# Altium project nano_carrier_V_1_1.PrjPcb
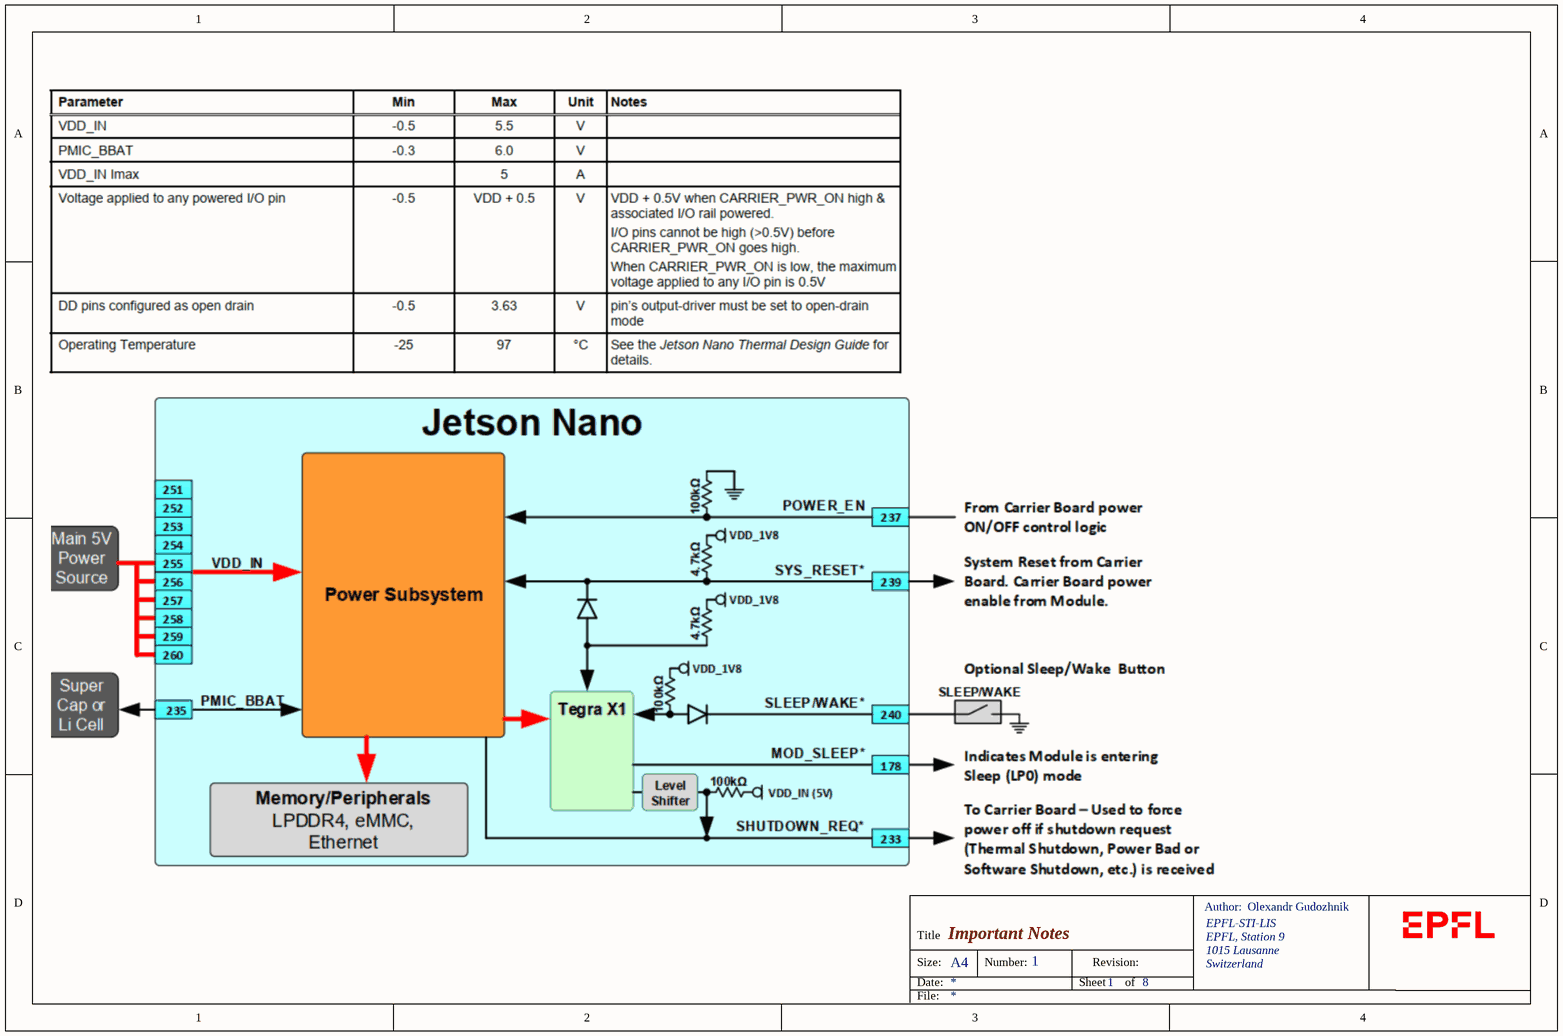
[diagram p0: notes.SchDoc]

8 sheets, 168 parts. Net scope: global (net labels, ports and power ports of the same name join across sheets).
Board file: nano_carrier_pcb.PcbDoc
Sheets:
  notes.SchDoc
  power.SchDoc
  jetson_nano_module.SchDoc
  uart.SchDoc
  usb.SchDoc
  uSDcard.SchDoc
  hdmi.SchDoc
  csi_cam.SchDoc

## Sheet notes.SchDoc: Important Notes
size A4; Author: Olexandr Gudozhnik; Organization: EPFL-STI-LIS; Address1: EPFL, Station 9; Address2: 1015 Lausanne; Address3: Switzerland; DocumentNumber: 1; SheetNumber: 1; SheetTotal: 8

### Notes on the sheet
- Author:
- Title
- Size:
- Date:
- A4
- Number:
- Sheet
- Revision:
- of
- File:

## Sheet power.SchDoc: Power supplies & sequencing
size A4; Author: Olexandr Gudozhnik; Organization: EPFL-STI-LIS; Address1: EPFL, Station 9; Address2: 1015 Lausanne; Address3: Switzerland; DocumentNumber: 2; SheetNumber: 2; SheetTotal: 8
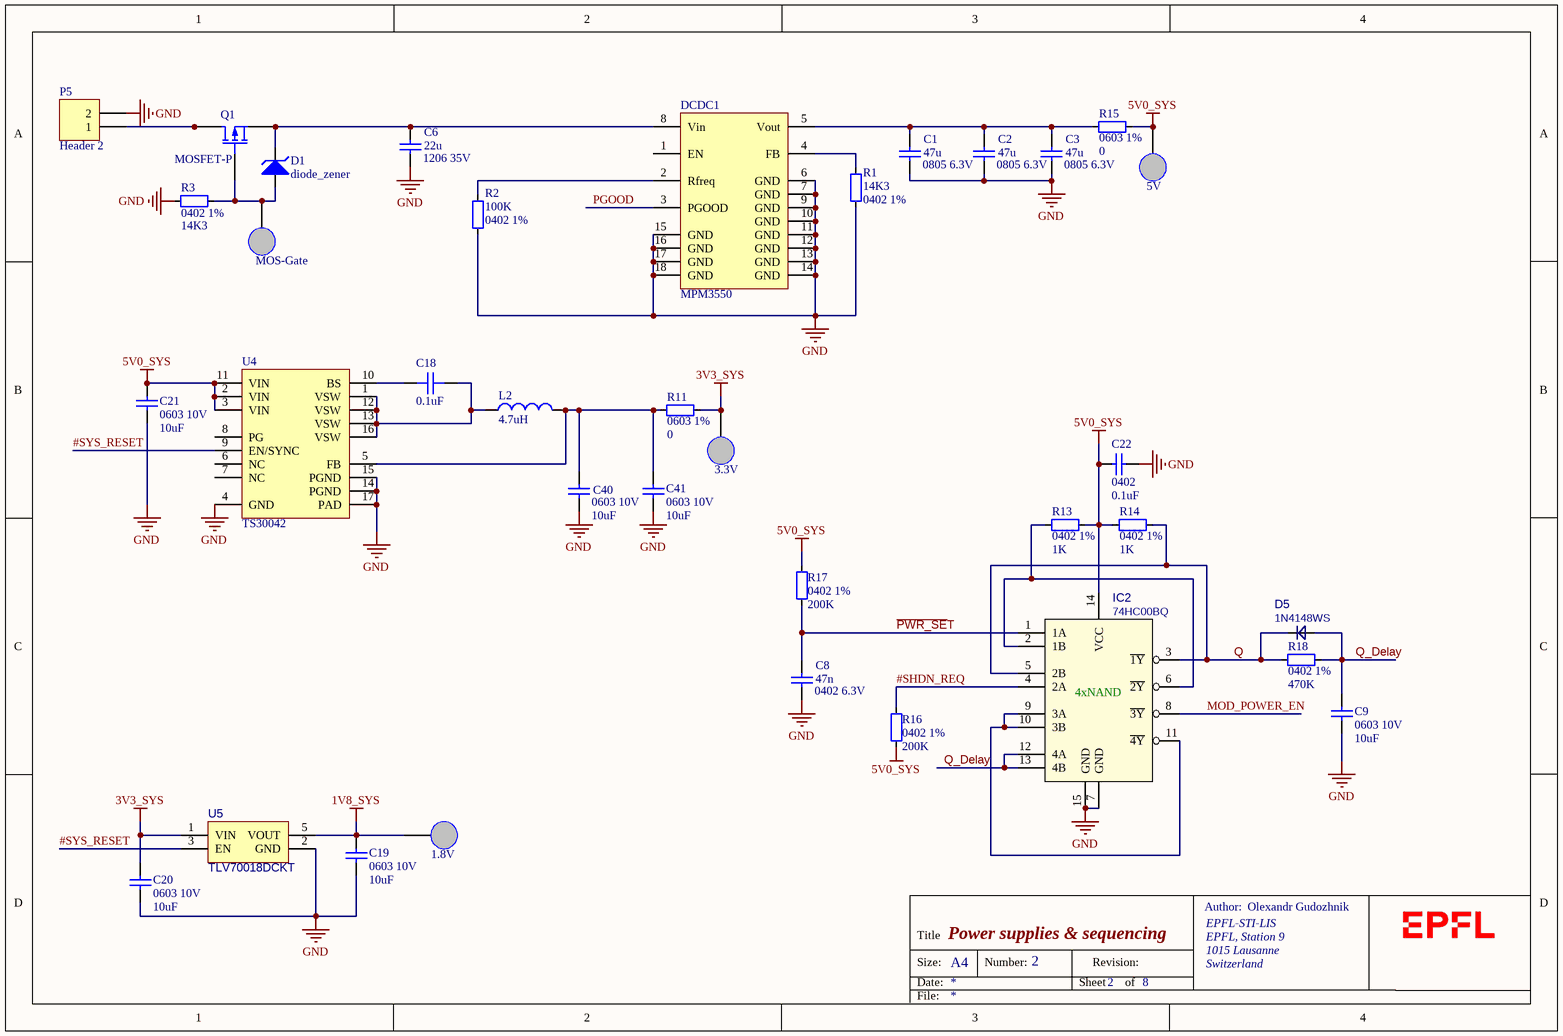
[diagram p1: power.SchDoc]

### Parts
1.8V  TP  [test_point]  (value not drawn)  (no BOM)
3.3V  TP  [test_point]  (value not drawn)  (no BOM)
5V  TP  [test_point]  (value not drawn)  (no BOM)
C1  0805 6.3V  value 47u  [cap0805]
C2  0805 6.3V  value 47u  [cap0805]
C3  0805 6.3V  value 47u  [cap0805]
C6  1206 35V  value 22u  [cap1206]
C8  0402 6.3V  value 47n  [cap0402]
C9  0603 10V  value 10uF  [cap0603]
C18  value 0.1uF  [CAP0603]  (hidden comment: .Value)
C19  0603 10V  value 10uF  [cap0603]
C20  0603 10V  value 10uF  [cap0603]
C21  0603 10V  value 10uF  [cap0603]
C22  0402  value 0.1uF  [cap0402]
C40  0603 10V  value 10uF  [cap0603]
C41  0603 10V  value 10uF  [cap0603]
D1  diode_zener  [sod323]
D5  1N4148WS  [SOD-323]
DCDC1  MPM3550  [MPM3550E]
IC2  74HC00BQ  [DHVQFN14]
L2  value 4.7uH  [NRS5030]  (hidden comment: Inductor)
MOS-Gate  TP  [test_point]  (value not drawn)  (no BOM)
P5  Header 2  [xt30_fem_hor]
Q1  MOSFET-P  [DFN8_5x6]
R1  0402 1%  value 14K3  [res0402]
R2  0402 1%  value 100K  [res0402]
R3  0402 1%  value 14K3  [res0402]
R11  0603 1%  value 0  [res0603]
R13  0402 1%  value 1K  [res0402]
R14  0402 1%  value 1K  [res0402]
R15  0603 1%  value 0  [res0603]
R16  0402 1%  value 200K  [res0402]
R17  0402 1%  value 200K  [res0402]
R18  0402 1%  value 470K  [res0402]
U4  TS30042  [qfn16_TP]
U5  TLV70018DCKT  [SC70-5]

### Nets
1V8_SYS: 1.8V.1(TP) C19.2 U5.5(VOUT)
3V3_SYS: 3.3V.1(TP) C20.2 R11.1 U5.1(VIN)
5V0_SYS: 5V.1(TP) C21.2 C22.2 IC2.14(VCC) R13.1 R14.2 R15.1 R16.2 R17.1 U4.2(VIN) U4.3(VIN) U4.11(VIN)
GND: C1.2 C2.2 C3.2 C6.2 C8.2 C9.1 C19.1 C20.1 C21.1 C22.1 C40.1 C41.1 DCDC1.6(GND) DCDC1.7(GND) DCDC1.9(GND) DCDC1.10(GND) DCDC1.11(GND) DCDC1.12(GND) DCDC1.13(GND) DCDC1.14(GND) DCDC1.15(GND) DCDC1.16(GND) DCDC1.17(GND) DCDC1.18(GND) IC2.7(GND) IC2.15(GND) P5.2 R1.1 R2.1 R3.2 U4.4(GND) U4.14(PGND) U4.15(PGND) U4.17(PAD) U5.2(GND)
#SHDN_REQ: IC2.4(2A) R16.1
#SYS_RESET: U4.9(EN/SYNC) U5.3(EN)
~{PWR_SE}T: C8.1 IC2.1(1A) R17.2
MOD_POWER_EN: IC2.8(~{3Y})
PGOOD: DCDC1.3(PGOOD)
Q: D5.C IC2.3(~{1Y}) IC2.5(2B) R14.1 R18.2
Q_Delay: C9.2 D5.A IC2.12(4A) IC2.13(4B) R18.1
NetC1_1: C1.1 C2.1 C3.1 DCDC1.5(Vout) R15.2
NetC6_1: C6.1 D1.2(K) DCDC1.8(Vin) Q1.1(S) Q1.2(S) Q1.3(S)
NetC18_1: C18.1 U4.10(BS)
NetC18_2: C18.2 L2.1 U4.1(VSW) U4.12(VSW) U4.13(VSW) U4.16(VSW)
NetC40_2: C40.2 C41.2 L2.2 R11.2 U4.5(FB)
NetD1_1: D1.1(A) MOS-Gate.1(TP) Q1.4(G) R3.1
NetDCDC1_2: DCDC1.2(Rfreq) R2.2
NetDCDC1_4: DCDC1.4(FB) R1.2
NetIC2_2: IC2.2(1B) IC2.6(~{2Y}) R13.2
NetIC2_9: IC2.9(3A) IC2.10(3B) IC2.11(~{4Y})
NetP5_1: P5.1 Q1.5(D) Q1.6(D) Q1.7(D) Q1.8(D)

Not connected (* = marked no-connect by the designer): DCDC1 1(EN); U4 6(NC) 7(NC) 8(PG)

### Notes on the sheet
- Author:
- Title
- Size:
- Date:
- A4
- Number:
- Sheet
- Revision:
- of
- File:
- (in symbol 74HC00BQ) 4xNAND

### Library data of the parts
1.8V 3.3V 5V MOS-Gate = TP: Test point
C1-C3 C6 C8 = cap_no_param: Supplier 1: Digi-Key
  C1-C3: Supplier Part Number 1: 587-4280-1-ND
  C6: Supplier Part Number 1: 445-8045-1-ND
  C8: Supplier Part Number 1: 490-6335-1-ND
C9 C19-C22 C40 C41 = cap: standard, non-polarized capacitor; Supplier 1: Digi-Key; Footprint verified: no
  C9 C19-C21 C40 C41: Supplier Part Number 1: 490-10474-1-ND; Supplier Price 1: 0.23
  C22: Supplier Part Number 1: 490-14603-1-ND; Supplier Price 1: 0.08
C18 = capacitor_smd_0603_25V: Ceramic capacitor, SMD, 0603, 25V, 10%, X7R; PackageReference: RAD-0.3; PackageDescription: Radial Cap, Thru-Hole; 2 Leads; 0.3 in Pin Spacing; Digikey Unit Price: 0.08; Supplier 1: Digi-Key; Supplier Part Number 1: 490-6051-1-ND
D1 = diode_zener: Zener diode; Published: 8-Jun-2000; LatestRevisionDate: 17-Jul-2002; LatestRevisionNote: Re-released for DXP Platform.; PackageReference: DIODE-0.7; Publisher: Altium Limited; PackageDescription: Diode, Thru-Hole; 2 Leads; 0.7 in Pin Spacing; Supplier 1: Digi-Key; Supplier Part Number 1: MMSZ5240BS-FDICT-ND
D5 = diode: Diode small signal; Manufacturer: ON SEMICONDUCTOR; PartNumber: 1N4148WS; Value: 1N4148WS; PartSymbol: 1N4148WS; Supplier 1: Digi-Key; Supplier Part Number 1: 1N4148WSFSCT-ND
IC2 = 74HC00BQ: 2 NAND Gate, 4 channel; Manufacturer: NEXPERIA; PartNumber: 74HC00BQ; Value: 74HC00BQ; PartSymbol: 74HC00BQ; Supplier 1: Digi-Key; Supplier Part Number 1: 1727-3213-1-ND
L2 = Inductor: Code_IEC: 1005; PackageReference: 0402-A; PackageDescription: Chip Inductor; Code_JEITA: 0402; dIGIKEY rEF: 445-2182-1-ND; Supplier 1: Digi-Key; Supplier Part Number 1: 587-3605-1-ND
P5 = Header 2: Header, 2-Pin; LatestRevisionDate: 17-Jul-2002; LatestRevisionNote: Re-released for DXP Platform.; Publisher: Altium Limited
Q1 = pmos_dfn8: P-Channel MOSFET in DFN8 package (DFN5); Published: 8-Jun-2000; LatestRevisionDate: 17-Jul-2002; LatestRevisionNote: Re-released for DXP Platform.; PackageVersion: 1995/1996; PackageReference: E3; Publisher: Altium Limited; PackageDescription: TO, Flat Index; 3 In-Line, Axial Leads; Body Dia. 4.6mm; Lead Dia. 0.5 mm (max); Supplier 1: Digi-Key; Supplier Part Number 1: FDWS9508L-F085OSCT-ND
R1 R3 = res: Supplier 1: Digi-Key; Supplier Part Number 1: P14.3KLCT-ND
R2 R11 R13-R18 = res: 100K; Supplier 1: Digi-Key
  R2: Supplier Part Number 1: P100KLCT-ND
  R11 R15: Supplier Part Number 1: 311-0.0GRCT-ND
  R13 R14: Supplier Part Number 1: P1.00KLCT-ND
  R16 R17: Supplier Part Number 1: P200KLCT-ND
  R18: Supplier Part Number 1: P470KLCT-ND
U4 = TS30042: 40V,2A  synch voltage reg, QFN16 3x3mm; Manufacturer: National Semiconductor; PackageTopMarking: NS*UZXYTT*S0003LB; CompType: Switcher; PowerWise: N; PackageReference: SRC14A; RevisionNote: Component URLs added; PackageVersion: revA, Jul-2003; PackageDescription: LLP, Plastic, Dual, 6 x 5 x 1mm Body, 14 Lead, 0.8mm Pitch, No Pullback; PinCount: 14; Digikey Ref: LM2676SD-12/NOPBCT-ND; Footprint verified: no; Supplier 1: Digi-Key; Supplier Part Number 1: TS30042-M033QFNRCT-ND
U5 = TLV700: Voltage Regulator, 2V to 5.5V, 175mV Dropout, 1.8Vout, 200mAout; Manufacturer: TEXAS INSTRUMENTS; Value: TLV70018DCKT; PartNumber: TLV70018DCKT; PartSymbol: TLV70018DCKT; Supplier 1: Digi-Key; Supplier Part Number 1: 296-25269-1-ND
DCDC1 = MPM3550: Supplier 1: Digi-Key; Supplier Part Number 1: 1589-2043-ND

## Sheet jetson_nano_module.SchDoc: Jetson Nano Module
size A3; Author: Olexandr Gudozhnik; Organization: EPFL-STI-LIS; Address1: EPFL, Station 9; Address2: 1015, Lausanne; Address3: Switzerland; DocumentNumber: 3; SheetNumber: 3; SheetTotal: 8
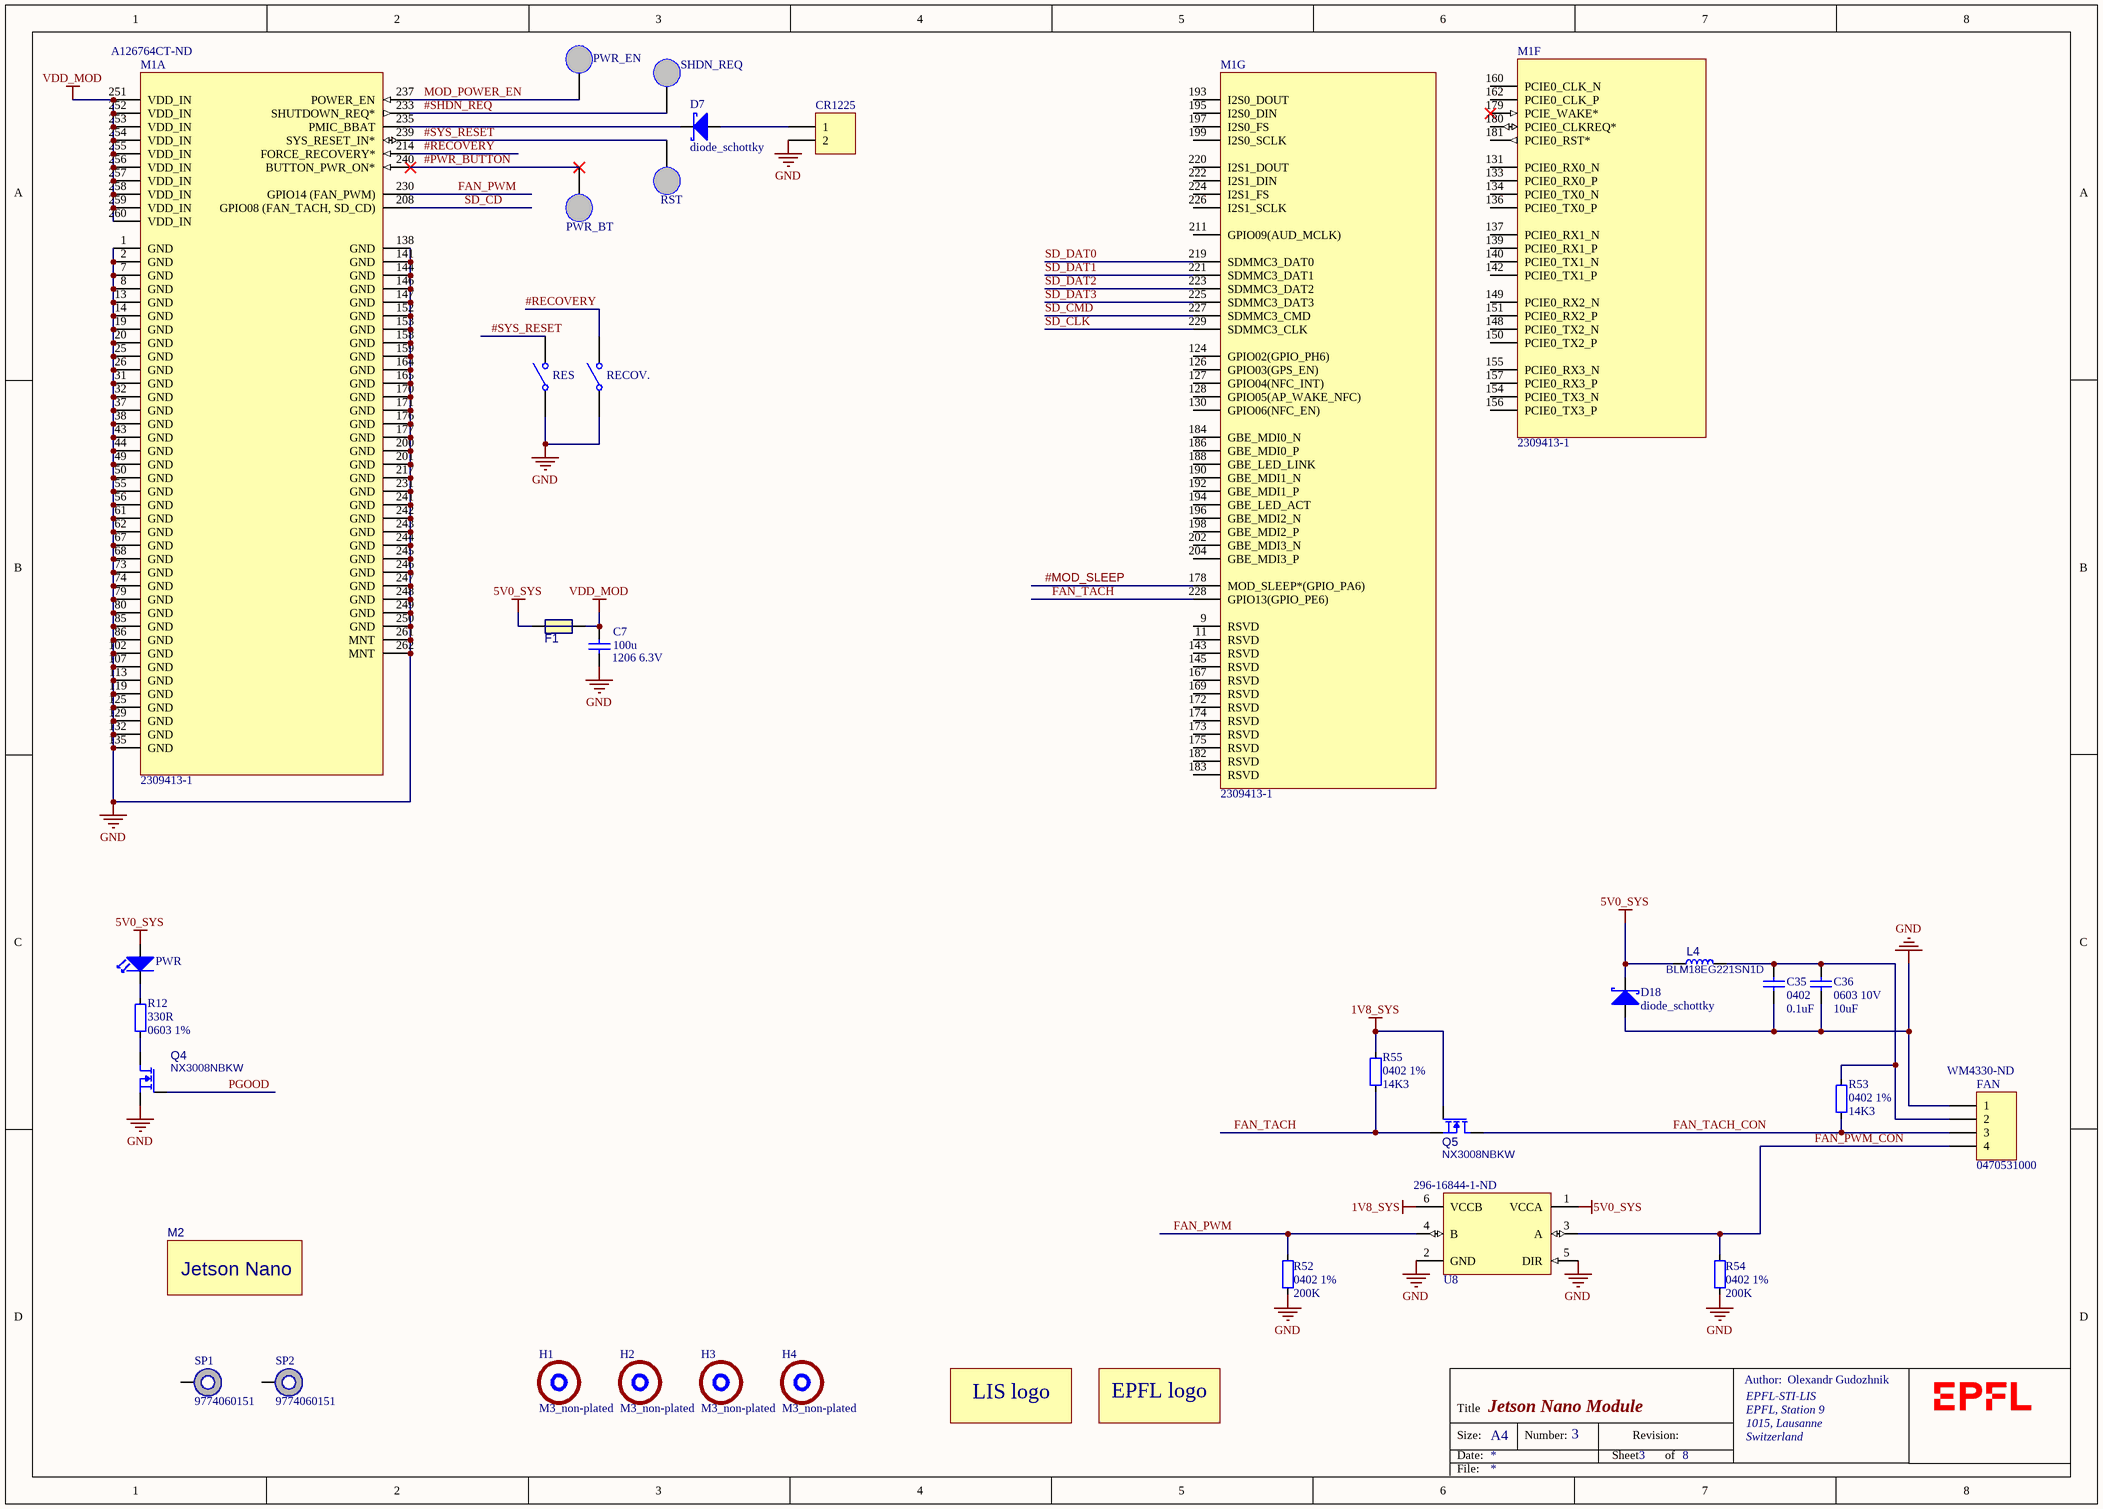
[diagram p2: jetson_nano_module.SchDoc]

### Parts
C7  1206 6.3V  value 100u  [cap1206]
C35  0402  value 0.1uF  [cap0402]
C36  0603 10V  value 10uF  [cap0603]
CR1225  Header 2  [CR1225_Holder]  (value not drawn)
D7  diode_schottky  [DFN1608D-2]
D18  diode_schottky  [DFN1608D-2]
F1  1206L450SLWR  [res1206]  (value not drawn)
FAN  0470531000  Supplier Part Number 1: WM4330-ND  [47053-1000]
H1  M3_non-plated  [M3_NON_PLATED]  (no BOM)
H2  M3_non-plated  [M3_NON_PLATED]  (no BOM)
H3  M3_non-plated  [M3_NON_PLATED]  (no BOM)
H4  M3_non-plated  [M3_NON_PLATED]  (no BOM)
L4  BLM18EG221SN1D  [fb0603]
logo1  LIS_LOGO  [lis_logo]  (value not drawn)  (graphical)
logo2  EPFL_LOGO  [epfl_logo]  (value not drawn)  (graphical)
M1  2309413-1  Supplier Part Number 1: A126764CT-ND  [jetson-nano-connector]  (parts A,F,G of 7)
M2  (no value)  [jetson-nano-module]  (no BOM)
PWR  green LED  [led_0603]  (value not drawn)
PWR_BT  TP  [test_point]  (value not drawn)  (no BOM)
PWR_EN  TP  [test_point]  (value not drawn)  (no BOM)
Q4  NX3008NBKW  [SC70-3]
Q5  NX3008NBKW  [SC70-3]
R12  0603 1%  value 330R  [res0603]
R52  0402 1%  value 200K  [res0402]
R53  0402 1%  value 14K3  [res0402]
R54  0402 1%  value 200K  [res0402]
R55  0402 1%  value 14K3  [res0402]
RECOV.  B3U1000P  [b3u_1000p]  (value not drawn)
RES  B3U1000P  [b3u_1000p]  (value not drawn)
RST  TP  [test_point]  (value not drawn)  (no BOM)
SHDN_REQ  TP  [test_point]  (value not drawn)  (no BOM)
SP1  9774060151  [M2.5-6mm]  (mechanical)
SP2  9774060151  [M2.5-6mm]  (mechanical)
U8  Supplier Part Number 1: 296-16844-1-ND  [SC70-6]  (hidden comment: SN74LVC1T45)

### Nets
1V8_SYS: Q5.1(G) R55.1 U8.6(VCCB)
5V0_SYS: D18.1(K) F1.1 L4.1 PWR.1(A) U8.1(VCCA)
GND: C7.2 C35.1 C36.2 CR1225.2 D18.2(A) FAN.1 M1.1(GND) M1.2(GND) M1.7(GND) M1.8(GND) M1.13(GND) M1.14(GND) M1.19(GND) M1.20(GND) M1.25(GND) M1.26(GND) M1.31(GND) M1.32(GND) M1.37(GND) M1.38(GND) M1.43(GND) M1.44(GND) M1.49(GND) M1.50(GND) M1.55(GND) M1.56(GND) M1.61(GND) M1.62(GND) M1.67(GND) M1.68(GND) M1.73(GND) M1.74(GND) M1.79(GND) M1.80(GND) M1.85(GND) M1.86(GND) M1.102(GND) M1.107(GND) M1.113(GND) M1.119(GND) M1.125(GND) M1.129(GND) M1.132(GND) M1.135(GND) M1.138(GND) M1.141(GND) M1.144(GND) M1.146(GND) M1.147(GND) M1.152(GND) M1.153(GND) M1.158(GND) M1.159(GND) M1.164(GND) M1.165(GND) M1.170(GND) M1.171(GND) M1.176(GND) M1.177(GND) M1.200(GND) M1.201(GND) M1.217(GND) M1.231(GND) M1.241(GND) M1.242(GND) M1.243(GND) M1.244(GND) M1.245(GND) M1.246(GND) M1.247(GND) M1.248(GND) M1.249(GND) M1.250(GND) M1.261(MNT) M1.262(MNT) Q4.2(S) R52.2 R54.2 RECOV..1(COMMON) RES.1(COMMON) U8.2(GND) U8.5(DIR)
VDD_MOD: C7.1 F1.2 M1.251(VDD_IN) M1.252(VDD_IN) M1.253(VDD_IN) M1.254(VDD_IN) M1.255(VDD_IN) M1.256(VDD_IN) M1.257(VDD_IN) M1.258(VDD_IN) M1.259(VDD_IN) M1.260(VDD_IN)
#MOD_SLEEP: M1.178(MOD_SLEEP*(GPIO_PA6))
#PWR_BUTTON: M1.240(BUTTON_PWR_ON*) PWR_BT.1(TP)
#RECOVERY: M1.214(FORCE_RECOVERY*) RECOV..2(NO)
#SHDN_REQ: M1.233(SHUTDOWN_REQ*) SHDN_REQ.1(TP)
#SYS_RESET: M1.239(SYS_RESET_IN*) RES.2(NO) RST.1(TP)
FAN_PWM: M1.230(GPIO14_(FAN_PWM)) R52.1 U8.4(B)
FAN_PWM_CON: FAN.4 R54.1 U8.3(A)
FAN_TACH: M1.228(GPIO13(GPIO_PE6)) Q5.2(S) R55.2
FAN_TACH_CON: FAN.3 Q5.3(D) R53.2
MOD_POWER_EN: M1.237(POWER_EN) PWR_EN.1(TP)
PGOOD: Q4.1(G)
SD_CD: M1.208(GPIO08_(FAN_TACH,_SD_CD))
SD_CLK: M1.229(SDMMC3_CLK)
SD_CMD: M1.227(SDMMC3_CMD)
SD_DAT0: M1.219(SDMMC3_DAT0)
SD_DAT1: M1.221(SDMMC3_DAT1)
SD_DAT2: M1.223(SDMMC3_DAT2)
SD_DAT3: M1.225(SDMMC3_DAT3)
NetC35_2: C35.2 C36.1 FAN.2 L4.2 R53.1
NetCR1225_1: CR1225.1 D7.2(A)
NetD7_1: D7.1(K) M1.235(PMIC_BBAT)
NetPWR_2: PWR.2(K) R12.2
NetQ4_3: Q4.3(D) R12.1

Not connected (* = marked no-connect by the designer): M1 9(RSVD) 11(RSVD) 124(GPIO02(GPIO_PH6)) 126(GPIO03(GPS_EN)) 127(GPIO04(NFC_INT)) 128(GPIO05(AP_WAKE_NFC)) 130(GPIO06(NFC_EN)) 131(PCIE0_RX0_N) 133(PCIE0_RX0_P) 134(PCIE0_TX0_N) 136(PCIE0_TX0_P) 137(PCIE0_RX1_N) 139(PCIE0_RX1_P) 140(PCIE0_TX1_N) 142(PCIE0_TX1_P) 143(RSVD) 145(RSVD) 148(PCIE0_TX2_N) 149(PCIE0_RX2_N) 150(PCIE0_TX2_P) 151(PCIE0_RX2_P) 154(PCIE0_TX3_N) 155(PCIE0_RX3_N) 156(PCIE0_TX3_P) 157(PCIE0_RX3_P) 160(PCIE0_CLK_N) 162(PCIE0_CLK_P) 167(RSVD) 169(RSVD) 172(RSVD) 173(RSVD) 174(RSVD) 175(RSVD) 179(PCIE_WAKE*)* 180(PCIE0_CLKREQ*) 181(PCIE0_RST*) 182(RSVD) 183(RSVD) 184(GBE_MDI0_N) 186(GBE_MDI0_P) 188(GBE_LED_LINK) 190(GBE_MDI1_N) 192(GBE_MDI1_P) 193(I2S0_DOUT) 194(GBE_LED_ACT) 195(I2S0_DIN) 196(GBE_MDI2_N) 197(I2S0_FS) 198(GBE_MDI2_P) 199(I2S0_SCLK) 202(GBE_MDI3_N) 204(GBE_MDI3_P) 211(GPIO09(AUD_MCLK)) 220(I2S1_DOUT) 222(I2S1_DIN) 224(I2S1_FS) 226(I2S1_SCLK); SP1 1; SP2 1

### Notes on the sheet
- Author:
- Title
- Size:
- Date:
- A4
- Number:
- Sheet
- Revision:
- of
- File:
- (in symbol EPFL_LOGO) EPFL logo
- (in symbol jetson-nano-module) Jetson Nano
- (in symbol LIS_LOGO) LIS logo

### Library data of the parts
C7 = cap_no_param: Supplier 1: Digi-Key; Supplier Part Number 1: 399-5620-1-ND
C35 C36 = cap: standard, non-polarized capacitor; Supplier 1: Digi-Key; Footprint verified: no
  C35: Supplier Part Number 1: 490-14603-1-ND; Supplier Price 1: 0.08
  C36: Supplier Part Number 1: 490-10474-1-ND; Supplier Price 1: 0.23
CR1225 = Header 2: Header, 2-Pin; LatestRevisionDate: 17-Jul-2002; LatestRevisionNote: Re-released for DXP Platform.; Publisher: Altium Limited; Supplier 1: Digi-Key; Supplier Part Number 1: 36-3000CT-ND
D7 D18 = diode_schottky: Schottky diode; Published: 8-Jun-2000; LatestRevisionDate: 17-Jul-2002; LatestRevisionNote: Re-released for DXP Platform.; PackageReference: SMB; Publisher: Altium Limited; PackageDescription: DO-214-AA/SMB; 2 C-Bend Leads; Body 5.3 x 3.6 mm, inc. leads (LxW); Code_JEDEC: DO-214-AA; Supplier 1: Digi-Key; Supplier Part Number 1: 1727-1338-1-ND
F1 = Fuse: PTC RESET 6V LO RHO 1206 4.50A; PartNumber: LITTELFUSE_1206L450SLWR; Manufacturer: LITTELFUSE; Value: 1206L450SLWR; PartSymbol: 1206L450SLWR; Supplier 1: Digi-Key; Supplier Part Number 1: F5787CT-ND
FAN = Header 4: Fan header, 4-Pin; LatestRevisionDate: 17-Jul-2002; LatestRevisionNote: Re-released for DXP Platform.; Publisher: Altium Limited; Supplier 1: Digi-Key
H1-H4 = M3_non-plated_hole
L4 = BLM18EG221SN1D: MURATA  BLM18EG221SN1D  FERRITE BEAD, 0.05OHM, 2A, 0603; Value: BLM18EG221SN1D; Manufacturer: MURATA; PartNumber: BLM18EG221SN1D; PartSymbol: BLM18EG221SN1D; Supplier 1: Digi-Key; Supplier Part Number 1: 490-3992-1-ND
M1 = 2309413-1: Memory Socket, DDR4, SODIMM Socket, 260 Contacts, Copper Alloy, Gold Plated Contacts; Manufacturer: TE CONNECTIVITY; PartNumber: 2309413-1; Value: 2309413-1; PartSymbol: 2309413-1; Supplier 1: Digi-Key
M2 = jetson-nano-module: PartNumber: jetson-nano-module
PWR = diode_LED: Green LED 0603; Supplier 1: Digi-Key; Supplier Part Number 1: 475-2709-1-ND
PWR_BT PWR_EN RST SHDN_REQ = TP: Test point
Q4 Q5 = NMOS: MOSFET, N CH, 60V, 0.2A; Manufacturer: NXP; PartSymbol: BSS138PW; Value: NX3008NBKW; PartNumber: NX3008NBKW; Supplier 1: Digi-Key; Supplier Part Number 1: 1727-1280-1-ND
R12 R53 R55 = res: Supplier 1: Digi-Key
  R12: Supplier Part Number 1: 311-330HRCT-ND
  R53 R55: Supplier Part Number 1: P14.3KLCT-ND
R52 R54 = res: 100K; Supplier 1: Digi-Key
  R52: Supplier Part Number 1: P200KLCT-ND
  R54: Supplier Part Number 1: P100KLCT-ND
RECOV. RES = SW-SPST: Single-Pole, Single-Throw Switch; Published: 24-Mar-1999; LatestRevisionDate: 17-Jul-2002; LatestRevisionNote: Re-released for DXP Platform.; PackageReference: SPST-2; Publisher: Altium Limited; PackageDescription: Switch; 2 Leads; Supplier 1: Digi-Key; Supplier Part Number 1: SW1020CT-ND
SP1 SP2 = SPACER: M2.5-6mm; PartNumber: M2.5x6; Manufacturer: WURTH ELEKTRONIK; Value: 9774060151; PartSymbol: 9774060151; Supplier 1: Digi-Key; Supplier Part Number 1: 732-12984-ND
U8 = SN74LVC1T45: 1.8 - 5.5V fast level translator; Supplier 1: Digi-Key

## Sheet uart.SchDoc: UART & I2C
size A3; Author: Olexandr Gudozhnik; Organization: EPFL-STI-LIS; Address1: EPFL, Station 9; Address2: 1015, Lausanne; Address3: Switzerland; DocumentNumber: 4; SheetNumber: 4; SheetTotal: 8
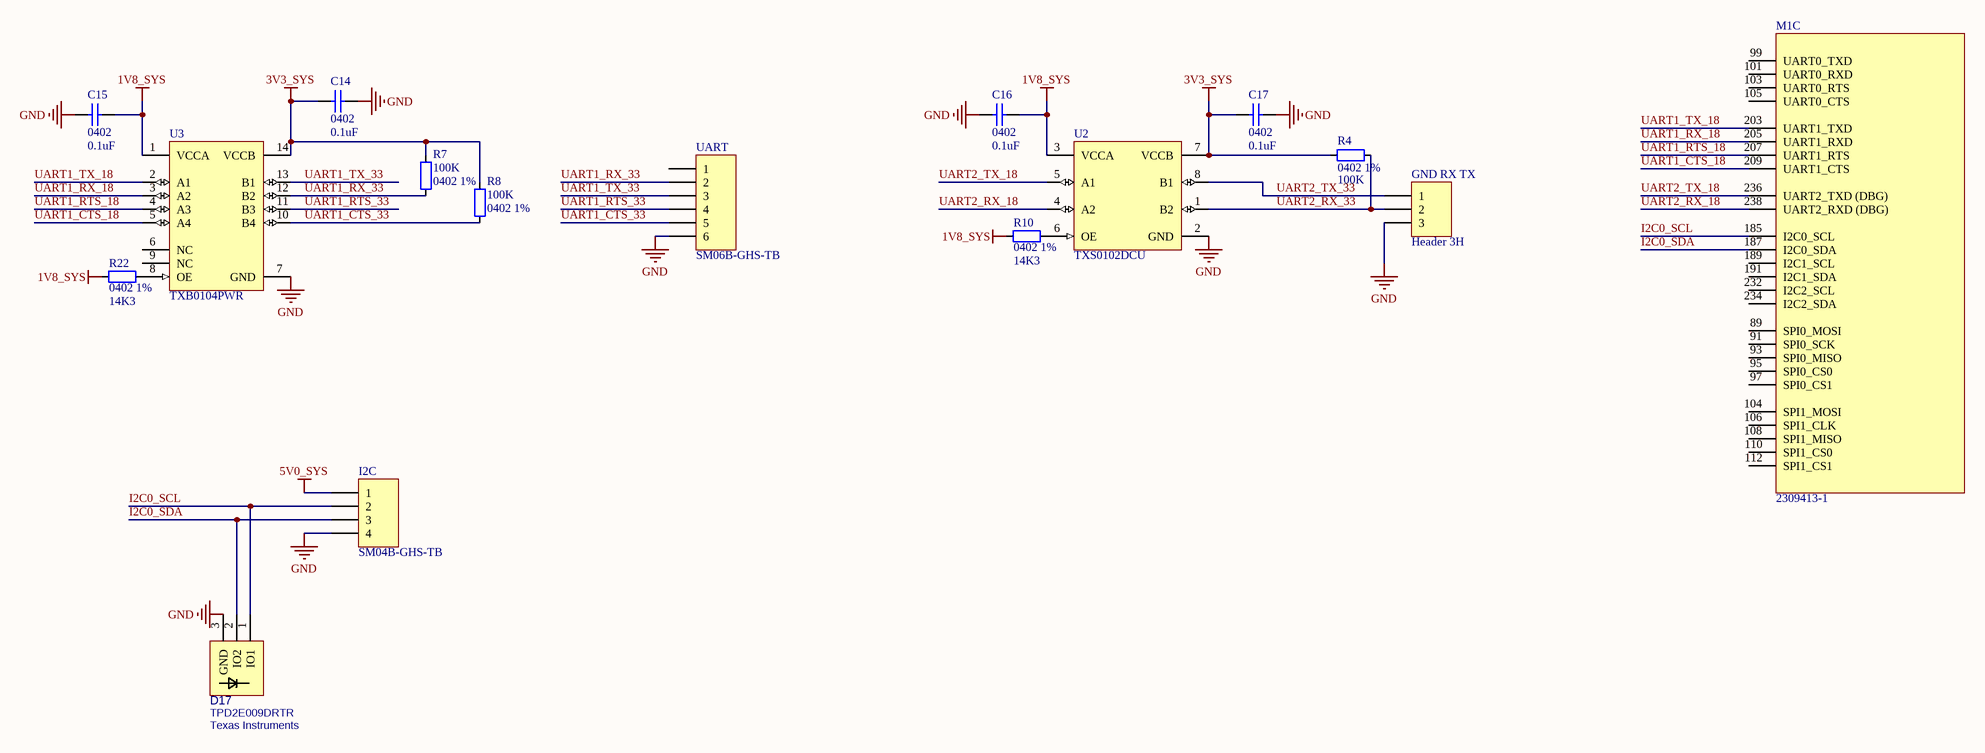
[diagram p3: uart.SchDoc]

### Parts
C14  0402  value 0.1uF  [cap0402]
C15  0402  value 0.1uF  [cap0402]
C16  0402  value 0.1uF  [cap0402]
C17  0402  value 0.1uF  [cap0402]
D17  TPD2E009DRTR  Manufacturer: Texas Instruments  [SOT-3]
GND_RX_TX  Header 3H  [header_vert_2.54_3pin]
I2C  SM04B-GHS-TB  [JST_GH_4_side]
M1  2309413-1  [jetson-nano-connector]  (part C of 7)
R4  0402 1%  value 100K  [res0402]
R7  0402 1%  value 100K  [res0402]
R8  0402 1%  value 100K  [res0402]
R10  0402 1%  value 14K3  [res0402]
R22  0402 1%  value 14K3  [res0402]
U2  TXS0102DCU  [TSOP8_065pitch]
U3  TXB0104PWR  [PW0014A_L]
UART  SM06B-GHS-TB  [JST_GH_6_side]

### Nets
1V8_SYS: C15.1 C16.1 R10.2 R22.2 U2.3(VCCA) U3.1(VCCA)
3V3_SYS: C14.2 C17.2 R4.2 R7.2 R8.2 U2.7(VCCB) U3.14(VCCB)
5V0_SYS: I2C.1
GND: C14.1 C15.2 C16.2 C17.1 D17.3(GND) GND_RX_TX.3 I2C.4 U2.2(GND) U3.7(GND) UART.6
I2C0_SCL: D17.1(IO1) I2C.2 M1.185(I2C0_SCL)
I2C0_SDA: D17.2(IO2) I2C.3 M1.187(I2C0_SDA)
UART1_CTS_18: M1.209(UART1_CTS) U3.5(A4)
UART1_CTS_33: R8.1 U3.10(B4) UART.5
UART1_RTS_18: M1.207(UART1_RTS) U3.4(A3)
UART1_RTS_33: U3.11(B3) UART.4
UART1_RX_18: M1.205(UART1_RXD) U3.3(A2)
UART1_RX_33: R7.1 U3.12(B2) UART.2
UART1_TX_18: M1.203(UART1_TXD) U3.2(A1)
UART1_TX_33: U3.13(B1) UART.3
UART2_RX_18: M1.238(UART2_RXD_(DBG)) U2.4(A2)
UART2_RX_33: GND_RX_TX.2 R4.1 U2.1(B2)
UART2_TX_18: M1.236(UART2_TXD_(DBG)) U2.5(A1)
UART2_TX_33: GND_RX_TX.1 U2.8(B1)
NetR10_1: R10.1 U2.6(OE)
NetR22_1: R22.1 U3.8(OE)

Not connected (* = marked no-connect by the designer): M1 89(SPI0_MOSI) 91(SPI0_SCK) 93(SPI0_MISO) 95(SPI0_CS0) 97(SPI0_CS1) 99(UART0_TXD) 101(UART0_RXD) 103(UART0_RTS) 104(SPI1_MOSI) 105(UART0_CTS) 106(SPI1_CLK) 108(SPI1_MISO) 110(SPI1_CS0) 112(SPI1_CS1) 189(I2C1_SCL) 191(I2C1_SDA) 232(I2C2_SCL) 234(I2C2_SDA); U3 6(NC) 9(NC); UART 1

### Notes on the sheet
- Author:
- Title
- Size:
- Date:
- A4
- Number:
- Sheet
- Revision:
- of
- File:

### Library data of the parts
C14-C17 = cap: standard, non-polarized capacitor; Supplier 1: Digi-Key; Supplier Part Number 1: 490-14603-1-ND; Supplier Price 1: 0.08; Footprint verified: no
D17 = TPD2E009: ESD Suppressors 2-CH; PartNumber: TPD2E009DRTR; Value: TPD2E009DRTR; PartSymbol: TPD2E009DRTR; Supplier 1: Digi-Key; Supplier Part Number 1: 296-25410-1-ND
GND_RX_TX = Header 3H: Header, 3-Pin, Right Angle; LatestRevisionDate: 17-Jul-2002; LatestRevisionNote: Re-released for DXP Platform.; Publisher: Altium Limited
I2C = Header 4: Header, 4-Pin; LatestRevisionDate: 17-Jul-2002; LatestRevisionNote: Re-released for DXP Platform.; Publisher: Altium Limited; Supplier 1: Digi-Key; Supplier Part Number 1: 455-1566-1-ND
M1 = 2309413-1: as M1 on sheet jetson_nano_module; PartNumber: 2309413-1; Value: 2309413-1; PartSymbol: 2309413-1
R4 R7 R8 = res: 100K; Supplier 1: Digi-Key; Supplier Part Number 1: P100KLCT-ND
R10 R22 = res: Supplier 1: Digi-Key; Supplier Part Number 1: P14.3KLCT-ND
U2 = TXS0102DCU: Bidirectional voltage level translator; Supplier 1: Digi-Key; Supplier Part Number 1: 296-32603-1-ND
U3 = TXB0104PWR: Bidir. voltage level translator; Supplier 1: Digi-Key; Supplier Part Number 1: 296-21929-1-ND
UART = Header 6: Header, 6-Pin; LatestRevisionDate: 17-Jul-2002; LatestRevisionNote: Re-released for DXP Platform.; Publisher: Altium Limited; Supplier 1: Digi-Key; Supplier Part Number 1: 455-1568-1-ND

## Sheet usb.SchDoc: USB interfaces
size A3; Author: Olexandr Gudozhnik; Organization: EPFL-STI-LIS; Address1: EPFL, Station 9; Address2: 1015 Lausanne; Address3: Switzerland; DocumentNumber: 5; SheetNumber: 5; SheetTotal: 8
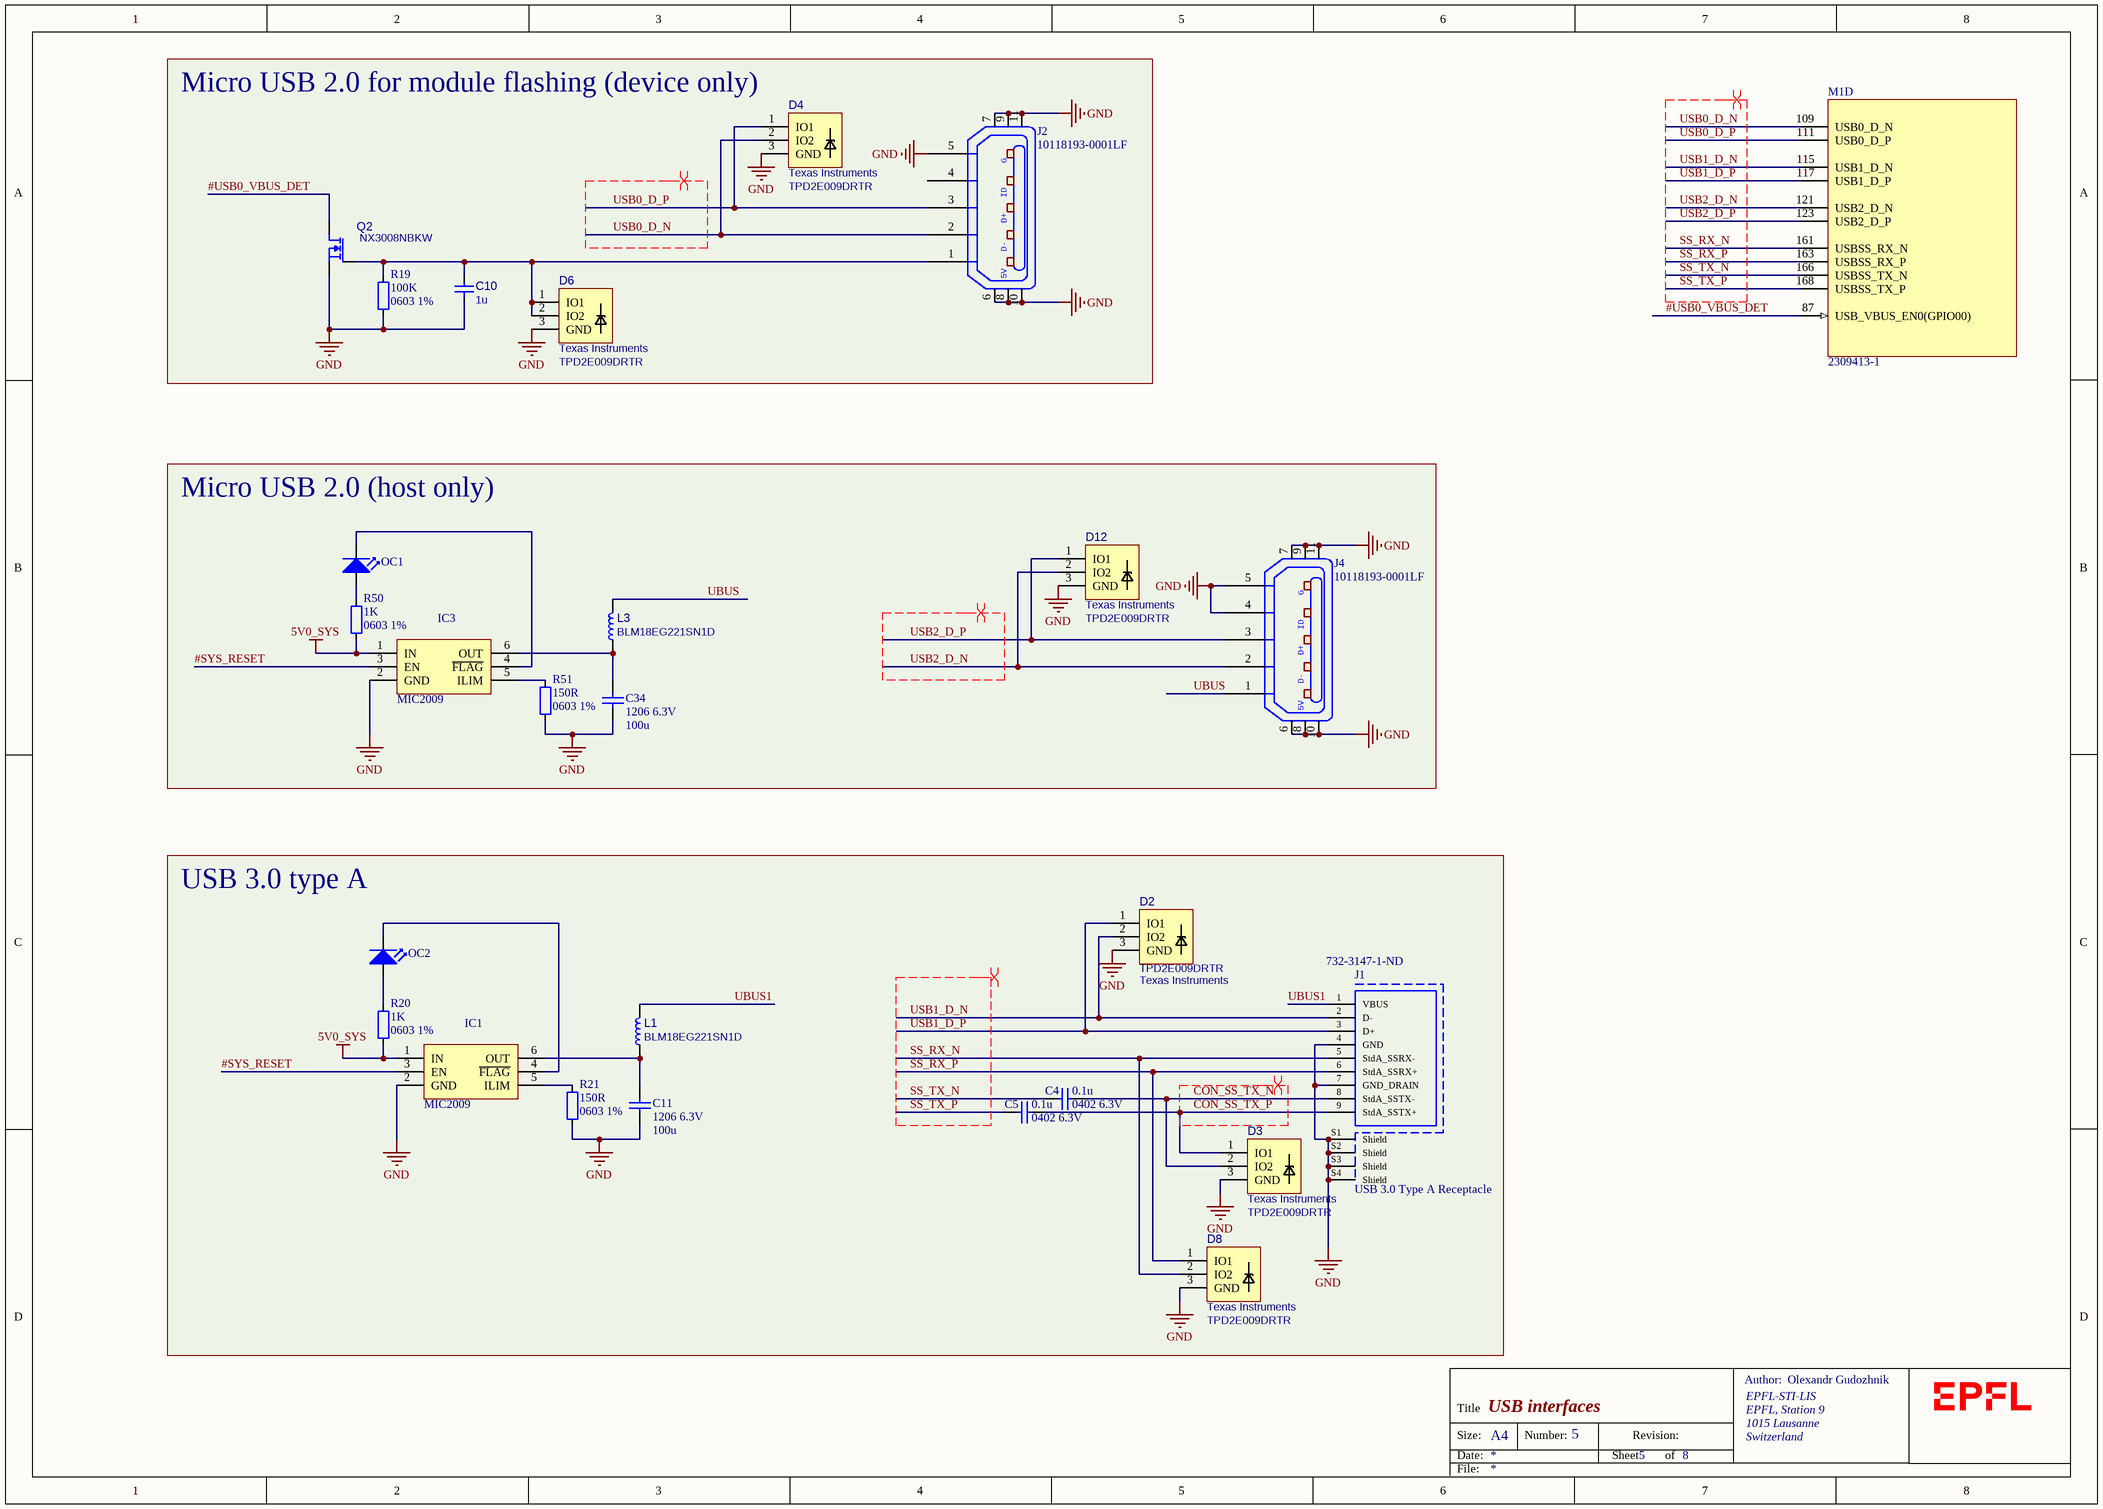
[diagram p4: usb.SchDoc]

### Parts
C4  0402 6.3V  value 0.1u  [cap0402]
C5  0402 6.3V  value 0.1u  [cap0402]
C10  1u  [0402]
C11  1206 6.3V  value 100u  [cap1206]
C34  1206 6.3V  value 100u  [cap1206]
D2  TPD2E009DRTR  Manufacturer: Texas Instruments  [SOT-3]
D3  TPD2E009DRTR  Manufacturer: Texas Instruments  [SOT-3]
D4  TPD2E009DRTR  Manufacturer: Texas Instruments  [SOT-3]
D6  TPD2E009DRTR  Manufacturer: Texas Instruments  [SOT-3]
D8  TPD2E009DRTR  Manufacturer: Texas Instruments  [SOT-3]
D12  TPD2E009DRTR  Manufacturer: Texas Instruments  [SOT-3]
IC1  MIC2009  [TSOP-6]
IC3  MIC2009  [TSOP-6]
J1  USB 3.0 Type A Receptacle  Supplier Part Number 1: 732-3147-1-ND  [692121230100]
J2  10118193-0001LF  [micro_usb_TH_RA_10118193]
J4  10118193-0001LF  [micro_usb_TH_RA_10118193]
L1  BLM18EG221SN1D  [fb0603]
L3  BLM18EG221SN1D  [fb0603]
M1  2309413-1  [jetson-nano-connector]  (part D of 7)
OC1  diode_LED  [led_0603]  (value not drawn)
OC2  diode_LED  [led_0603]  (value not drawn)
Q2  NX3008NBKW  [SC70-3]
R19  0603 1%  value 100K  [res0603]
R20  0603 1%  value 1K  [res0603]
R21  0603 1%  value 150R  [res0603]
R50  0603 1%  value 1K  [res0603]
R51  0603 1%  value 150R  [res0603]

### Blocks framed on the sheet
Micro USB 2.0 for module flashing (device only): C10 D4 D6 J2 Q2 R19
Micro USB 2.0 (host only): C34 D12 IC3 J4 L3 OC1 R50 R51
USB 3.0 type A: C4 C5 C11 D2 D3 D8 IC1 J1 L1 OC2 R20 R21

### Nets
5V0_SYS: IC1.1(IN) IC3.1(IN) R20.1 R50.1
GND: C10.1 C11.1 C34.1 D2.3(GND) D3.3(GND) D4.3(GND) D6.3(GND) D8.3(GND) D12.3(GND) IC1.2(GND) IC3.2(GND) J1.4(GND) J1.7(GND_DRAIN) J1.S1(Shield) J1.S2(Shield) J1.S3(Shield) J1.S4(Shield) J2.5(P5) J2.6 J2.7 J2.8 J2.9 J2.10 J2.11 J4.4(P4) J4.5(P5) J4.6 J4.7 J4.8 J4.9 J4.10 J4.11 Q2.2(S) R19.1 R21.1 R51.1
#SYS_RESET: IC1.3(EN) IC3.3(EN)
#USB0_VBUS_DET: M1.87(USB_VBUS_EN0(GPIO00)) Q2.3(D)
CON_SS_TX_N: C4.2 D3.2(IO2) J1.8(StdA_SSTX-)
CON_SS_TX_P: C5.2 D3.1(IO1) J1.9(StdA_SSTX+)
SS_RX_N: D8.2(IO2) J1.5(StdA_SSRX-) M1.161(USBSS_RX_N)
SS_RX_P: D8.1(IO1) J1.6(StdA_SSRX+) M1.163(USBSS_RX_P)
SS_TX_N: C4.1 M1.166(USBSS_TX_N)
SS_TX_P: C5.1 M1.168(USBSS_TX_P)
UBUS: J4.1(P1) L3.2
UBUS1: J1.1(VBUS) L1.2
USB0_D_N: D4.2(IO2) J2.2(P2) M1.109(USB0_D_N)
USB0_D_P: D4.1(IO1) J2.3(P3) M1.111(USB0_D_P)
USB1_D_N: D2.2(IO2) J1.2(D-) M1.115(USB1_D_N)
USB1_D_P: D2.1(IO1) J1.3(D+) M1.117(USB1_D_P)
USB2_D_N: D12.2(IO2) J4.2(P2) M1.121(USB2_D_N)
USB2_D_P: D12.1(IO1) J4.3(P3) M1.123(USB2_D_P)
NetC10_2: C10.2 D6.1(IO1) D6.2(IO2) J2.1(P1) Q2.1(G) R19.2
NetC11_2: C11.2 IC1.6(OUT) L1.1
NetC34_2: C34.2 IC3.6(OUT) L3.1
NetIC1_4: IC1.4(~{FLAG}) OC2.2(K)
NetIC1_5: IC1.5(ILIM) R21.2
NetIC3_4: IC3.4(~{FLAG}) OC1.2(K)
NetIC3_5: IC3.5(ILIM) R51.2
NetOC1_1: OC1.1(A) R50.2
NetOC2_1: OC2.1(A) R20.2

Not connected (* = marked no-connect by the designer): J2 4(P4)

### Layout directives
differential pair; differential pair class DIFF90: CON_SS_TX_N, CON_SS_TX_P, SS_RX_N, SS_RX_P, SS_TX_N, SS_TX_P, USB0_D_N, USB0_D_P, USB1_D_N, USB1_D_P, USB2_D_N, USB2_D_P

### Notes on the sheet
- Author:
- Title
- Size:
- Date:
- A4
- Number:
- Sheet
- Revision:
- of
- File:
- (in symbol 10118193-0001LF) G; ID; D+; D-; 5V

### Library data of the parts
C4 C5 C11 C34 = cap_no_param: Supplier 1: Digi-Key
  C4 C5: Supplier Part Number 1: 490-14603-1-ND
  C11 C34: Supplier Part Number 1: 399-5620-1-ND
C10 = C_1u_0402: MLCC SMT Capacitor 1uF 0402; Manufacturer: MULTICOMP; PartSymbol: MC0402F105Z6R3CT; PartNumber: C_1u_0402; Value: 1u; Supplier 1: Digi-Key; Supplier Part Number 1: 445-9066-1-ND
D2-D4 D6 D8 D12 = TPD2E009: ESD Suppressors 2-CH; PartNumber: TPD2E009DRTR; Value: TPD2E009DRTR; PartSymbol: TPD2E009DRTR; Supplier 1: Digi-Key; Supplier Part Number 1: 296-25410-1-ND
IC1 IC3 = NCP380HSNAJAAT1G: POWER LOAD SWITCH, HIGH SIDE; Manufacturer: ON Semiconductor; Value: MIC2009; PartNumber: NCP380HSNAJAAT1G; PartSymbol: NCP380HSNAJAAT1G; Supplier 1: Digi-Key; Supplier Part Number 1: 576-1680-1-ND
J1 = 692121230100: USB 3.0 Type A, Receptacle, Horizontal, THR, with Offset 1.04mm; Rated Current: 1.8A; Pin Number: 9; Interface Type: Type A; Working Voltage: 30VAC; ComponentLink1Description: Manufacturer; ComponentLink1URL: http://www.we-online.de; ComponentLink2Description: Datasheet; ComponentLink2URL: https://katalog.we-online.com/em/datasheet/692121230100.pdf; Published Date: September 2019; Publisher: Wurth Elektronik; Part Number: 692121230100; Gender: Receptacle; Type: Horizontal; Packaging: Tape and Reel; Operating Temperature: -20 to +85degC; Mounting Technology: THR; Application: USB 3.0; Supplier 1: Digi-Key
J2 J4 = 10118193-0001LF: CONN USB MICRO B RECPT SMT+TH R/A; Manufacturer: FCI; Connector Type: USB - micro B; Number of Contacts: 5; Gender: Receptacle; Specifications: USB 2.0; .Creator: MM; .Checked PCB: RF; Supplier 1: Digi-Key; Manufacturer Part Number: 10118193-0001LF; RoHS: RoHS Compliant; Category: Connectors, Interconnects; Stock 1: 28642; Pricing 1: 1=0.46, 10=0.433, 25=0.3712, 50=0.3156, 100=0.3032, 250=0.27224, 500=0.25988 (USD); Packaging: Cut Tape (CT); Mounting Type: Surface Mount, Right Angle, Horizontal; Features: Shielded, Solder Retention; Ingress Protection: -; ComponentLink1URL: http://portal.fciconnect.com/Comergent//fci/drawing/10118193.pdf; ComponentLink1Description: http://portal.fciconnect.com/Comergent//fci/drawing/10118193.pdf; Supplier Part Number 1: 609-4616-1-ND; .Checked SCH: MM
L1 L3 = BLM18EG221SN1D: as L4 on sheet jetson_nano_module; Value: BLM18EG221SN1D; Manufacturer: MURATA; PartNumber: BLM18EG221SN1D; PartSymbol: BLM18EG221SN1D; Supplier 1: Digi-Key; Supplier Part Number 1: 490-3992-1-ND
M1 = 2309413-1: as M1 on sheet jetson_nano_module; PartNumber: 2309413-1; Value: 2309413-1; PartSymbol: 2309413-1
OC1 OC2 = diode_LED: standard LED; Supplier 1: Digi-Key; Supplier Part Number 1: 475-2506-1-ND
Q2 = NMOS: as Q4 on sheet jetson_nano_module; Value: NX3008NBKW; PartNumber: NX3008NBKW; Supplier 1: Digi-Key; Supplier Part Number 1: 1727-1280-1-ND
R19-R21 R50 R51 = res: 100K; Supplier 1: Digi-Key
  R19: Supplier Part Number 1: 311-100KHRCT-ND
  R20 R50: Supplier Part Number 1: 311-1.00KHRCT-ND
  R21 R51: Supplier Part Number 1: 311-150HRCT-ND

## Sheet uSDcard.SchDoc: uSD card interface
size A4; Author: Olexandr Gudozhnik; Organization: EPFL-STI-LIS; Address1: EPFL, Station 9; Address2: 1015 Lausanne; Address3: Switzerland; DocumentNumber: 6; SheetNumber: 6; SheetTotal: 8
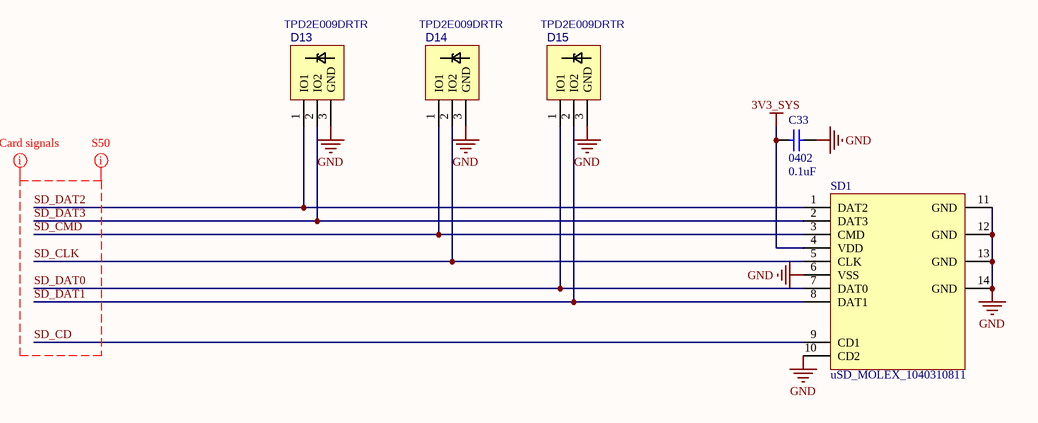
[diagram p5: uSDcard.SchDoc]

### Parts
C33  0402  value 0.1uF  [cap0402]
D13  TPD2E009DRTR  [SOT-3]
D14  TPD2E009DRTR  [SOT-3]
D15  TPD2E009DRTR  [SOT-3]
SD1  uSD_MOLEX_1040310811  [uSD_MOLEX_1040310811]

### Nets
3V3_SYS: C33.1 SD1.4(VDD)
GND: C33.2 D13.3(GND) D14.3(GND) D15.3(GND) SD1.6(VSS) SD1.10(CD2) SD1.11(GND) SD1.12(GND) SD1.13(GND) SD1.14(GND)
SD_CD: SD1.9(CD1)
SD_CLK: D14.2(IO2) SD1.5(CLK)
SD_CMD: D14.1(IO1) SD1.3(CMD)
SD_DAT0: D15.1(IO1) SD1.7(DAT0)
SD_DAT1: D15.2(IO2) SD1.8(DAT1)
SD_DAT2: D13.1(IO1) SD1.1(DAT2)
SD_DAT3: D13.2(IO2) SD1.2(DAT3)

### Layout directives
net class uSD: SD_CD, SD_CLK, SD_CMD, SD_DAT0, SD_DAT1, SD_DAT2, SD_DAT3
net class S50: SD_CD, SD_CLK, SD_CMD, SD_DAT0, SD_DAT1, SD_DAT2, SD_DAT3

### Notes on the sheet
- Author:
- Title
- Size:
- Date:
- A4
- Number:
- Sheet
- Revision:
- of
- File:

### Library data of the parts
C33 = cap: standard, non-polarized capacitor; Supplier 1: Digi-Key; Supplier Part Number 1: 490-14603-1-ND; Supplier Price 1: 0.08; Footprint verified: no
D13-D15 = TPD2E009: ESD Suppressors 2-CH; Manufacturer: Texas Instruments; PartNumber: TPD2E009DRTR; Value: TPD2E009DRTR; PartSymbol: TPD2E009DRTR; Supplier 1: Digi-Key; Supplier Part Number 1: 296-25410-1-ND
SD1 = uSD_MOLEX_1040310811: Supplier 1: Digi-Key; Supplier Part Number 1: WM6357CT-ND

## Sheet hdmi.SchDoc: HDMI type C interface
size A3; Author: Olexandr Gudozhnik; Organization: EPFL-STI-LIS; Address1: EPFL, Station 9; Address2: 1015 Lausanne; Address3: Switzerland; DocumentNumber: 7; SheetNumber: 7; SheetTotal: 8
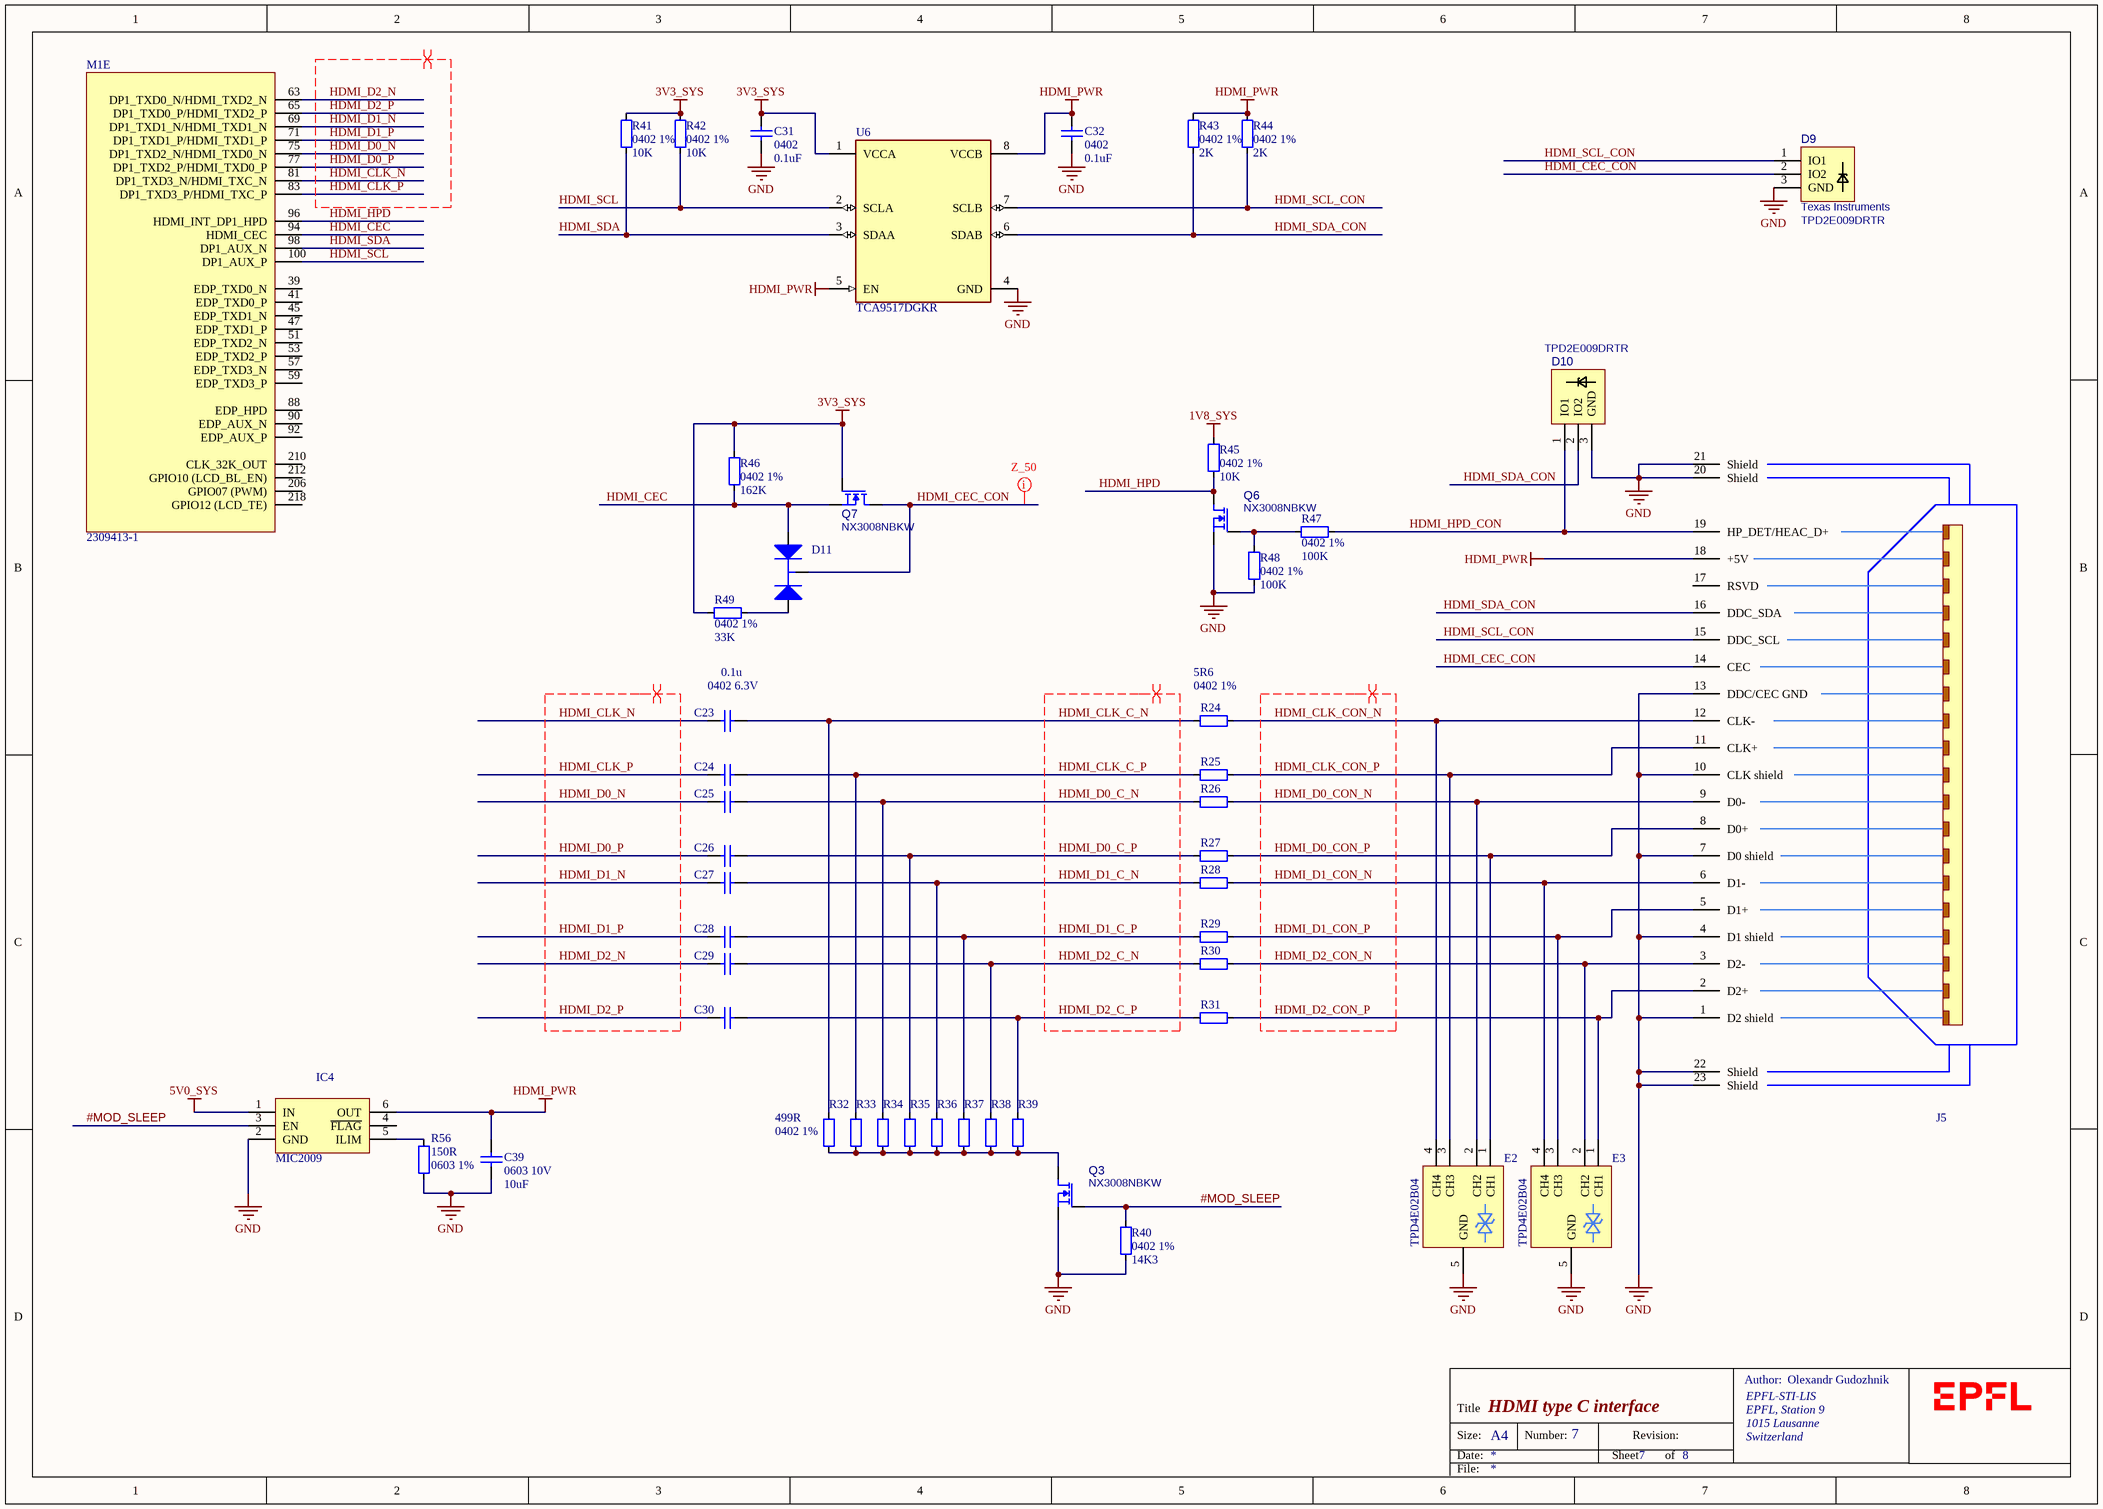
[diagram p6: hdmi.SchDoc]

### Parts
C23  0402 6.3V  value 0.1u  [cap0402_void]
C24  0402 6.3V  [cap0402_void]  (value not drawn)
C25  0402 6.3V  [cap0402_void]  (value not drawn)
C26  0402 6.3V  [cap0402_void]  (value not drawn)
C27  0402 6.3V  [cap0402_void]  (value not drawn)
C28  0402 6.3V  [cap0402_void]  (value not drawn)
C29  0402 6.3V  [cap0402_void]  (value not drawn)
C30  0402 6.3V  [cap0402_void]  (value not drawn)
C31  0402  value 0.1uF  [cap0402]
C32  0402  value 0.1uF  [cap0402]
C39  0603 10V  value 10uF  [cap0603]
D9  TPD2E009DRTR  Manufacturer: Texas Instruments  [SOT-3]
D10  TPD2E009DRTR  [SOT-3]
D11  .Value  [SC70]  (value not drawn)
E2  TPD4E02B04  [TPD4E02B04]
E3  TPD4E02B04  [TPD4E02B04]
IC4  MIC2009  [TSOP-6]
J5  HDMI_C  [mini_HDMI_WE_685119136923]  (value not drawn)
M1  2309413-1  [jetson-nano-connector]  (part E of 7)
Q3  NX3008NBKW  [SC70-3]
Q6  NX3008NBKW  [SC70-3]
Q7  NX3008NBKW  [SC70-3]
R24  0402 1%  value 5R6  [res0402_void]
R25  0402 1%  [res0402_void]  (value not drawn)
R26  0402 1%  [res0402_void]  (value not drawn)
R27  0402 1%  [res0402_void]  (value not drawn)
R28  0402 1%  [res0402_void]  (value not drawn)
R29  0402 1%  [res0402_void]  (value not drawn)
R30  0402 1%  [res0402_void]  (value not drawn)
R31  0402 1%  [res0402_void]  (value not drawn)
R32  0402 1%  value 499R  [res0402_void]
R33  0402 1%  [res0402_void]  (value not drawn)
R34  0402 1%  [res0402_void]  (value not drawn)
R35  0402 1%  [res0402_void]  (value not drawn)
R36  0402 1%  [res0402_void]  (value not drawn)
R37  0402 1%  [res0402_void]  (value not drawn)
R38  0402 1%  [res0402_void]  (value not drawn)
R39  0402 1%  [res0402_void]  (value not drawn)
R40  0402 1%  value 14K3  [res0402]
R41  0402 1%  value 10K  [res0402]
R42  0402 1%  value 10K  [res0402]
R43  0402 1%  value 2K  [res0402]
R44  0402 1%  value 2K  [res0402]
R45  0402 1%  value 10K  [res0402]
R46  0402 1%  value 162K  [res0402]
R47  0402 1%  value 100K  [res0402]
R48  0402 1%  value 100K  [res0402]
R49  0402 1%  value 33K  [res0402]
R56  0603 1%  value 150R  [res0603]
U6  TCA9517DGKR  [FP-DGK0008A-MFG]

### Nets
1V8_SYS: R45.1
3V3_SYS: C31.1 Q7.1(G) R41.1 R42.1 R46.2 R49.2 U6.1(VCCA)
5V0_SYS: IC4.1(IN)
GND: C31.2 C32.2 C39.1 D9.3(GND) D10.3(GND) E2.5(GND) E3.5(GND) IC4.2(GND) J5.1(D2_shield) J5.4(D1_shield) J5.7(D0_shield) J5.10(CLK_shield) J5.13(DDC/CEC_GND) J5.20(Shield) J5.21(Shield) J5.22(Shield) J5.23(Shield) Q3.2(S) Q6.2(S) R40.2 R48.1 R56.1 U6.4(GND)
HDMI_PWR: C32.1 C39.2 IC4.6(OUT) J5.18(+5V) R43.1 R44.1 U6.5(EN) U6.8(VCCB)
#MOD_SLEEP: IC4.3(EN) Q3.1(G) R40.1
HDMI_CEC: D11.1(A) M1.94(HDMI_CEC) Q7.2(S) R46.1
HDMI_CEC_CON: D9.2(IO2) D11.3(S) J5.14(CEC) Q7.3(D)
HDMI_CLK_C_N: C23.2 R24.1 R32.1
HDMI_CLK_C_P: C24.2 R25.1 R33.1
HDMI_CLK_CON_N: E2.4(CH4) J5.12(CLK-) R24.2
HDMI_CLK_CON_P: E2.3(CH3) J5.11(CLK+) R25.2
HDMI_CLK_N: C23.1 M1.81(DP1_TXD3_N/HDMI_TXC_N)
HDMI_CLK_P: C24.1 M1.83(DP1_TXD3_P/HDMI_TXC_P)
HDMI_D0_C_N: C25.2 R26.1 R34.1
HDMI_D0_C_P: C26.2 R27.1 R35.1
HDMI_D0_CON_N: E2.2(CH2) J5.9(D0-) R26.2
HDMI_D0_CON_P: E2.1(CH1) J5.8(D0+) R27.2
HDMI_D0_N: C25.1 M1.75(DP1_TXD2_N/HDMI_TXD0_N)
HDMI_D0_P: C26.1 M1.77(DP1_TXD2_P/HDMI_TXD0_P)
HDMI_D1_C_N: C27.2 R28.1 R36.1
HDMI_D1_C_P: C28.2 R29.1 R37.1
HDMI_D1_CON_N: E3.4(CH4) J5.6(D1-) R28.2
HDMI_D1_CON_P: E3.3(CH3) J5.5(D1+) R29.2
HDMI_D1_N: C27.1 M1.69(DP1_TXD1_N/HDMI_TXD1_N)
HDMI_D1_P: C28.1 M1.71(DP1_TXD1_P/HDMI_TXD1_P)
HDMI_D2_C_N: C29.2 R30.1 R38.1
HDMI_D2_C_P: C30.2 R31.1 R39.1
HDMI_D2_CON_N: E3.2(CH2) J5.3(D2-) R30.2
HDMI_D2_CON_P: E3.1(CH1) J5.2(D2+) R31.2
HDMI_D2_N: C29.1 M1.63(DP1_TXD0_N/HDMI_TXD2_N)
HDMI_D2_P: C30.1 M1.65(DP1_TXD0_P/HDMI_TXD2_P)
HDMI_HPD: M1.96(HDMI_INT_DP1_HPD) Q6.3(D) R45.2
HDMI_HPD_CON: D10.1(IO1) J5.19(HP_DET/HEAC_D+) R47.2
HDMI_SCL: M1.100(DP1_AUX_P) R42.2 U6.2(SCLA)
HDMI_SCL_CON: D9.1(IO1) J5.15(DDC_SCL) R44.2 U6.7(SCLB)
HDMI_SDA: M1.98(DP1_AUX_N) R41.2 U6.3(SDAA)
HDMI_SDA_CON: D10.2(IO2) J5.16(DDC_SDA) R43.2 U6.6(SDAB)
NetD11_2: D11.2(C) R49.1
NetIC4_5: IC4.5(ILIM) R56.2
NetQ3_3: Q3.3(D) R32.2 R33.2 R34.2 R35.2 R36.2 R37.2 R38.2 R39.2
NetQ6_1: Q6.1(G) R47.1 R48.2

Not connected (* = marked no-connect by the designer): IC4 4(~{FLAG}); J5 17(RSVD); M1 39(EDP_TXD0_N) 41(EDP_TXD0_P) 45(EDP_TXD1_N) 47(EDP_TXD1_P) 51(EDP_TXD2_N) 53(EDP_TXD2_P) 57(EDP_TXD3_N) 59(EDP_TXD3_P) 88(EDP_HPD) 90(EDP_AUX_N) 92(EDP_AUX_P) 206(GPIO07_(PWM)) 210(CLK_32K_OUT) 212(GPIO10_(LCD_BL_EN)) 218(GPIO12_(LCD_TE))

### Layout directives
differential pair; differential pair class DIFF100: HDMI_CLK_C_N, HDMI_CLK_C_P, HDMI_CLK_CON_N, HDMI_CLK_CON_P, HDMI_CLK_N, HDMI_CLK_P, HDMI_D0_C_N, HDMI_D0_C_P, HDMI_D0_CON_N, HDMI_D0_CON_P, HDMI_D0_N, HDMI_D0_P, HDMI_D1_C_N, HDMI_D1_C_P, HDMI_D1_CON_N, HDMI_D1_CON_P, HDMI_D1_N, HDMI_D1_P, HDMI_D2_C_N, HDMI_D2_C_P, HDMI_D2_CON_N, HDMI_D2_CON_P, HDMI_D2_N, HDMI_D2_P
rule Width Constraint [Pref Impedance = 50,00ohms    Min Impedance = 50,00ohms    Max Impedance = 50,00ohms]; net class S50: HDMI_CEC_CON

### Notes on the sheet
- Author:
- Title
- Size:
- Date:
- A4
- Number:
- Sheet
- Revision:
- of
- File:

### Library data of the parts
C23 = cap_no_param: Supplier 1: Digi-Key; Supplier Part Number 1: 490-14603-1-ND
C24-C30 = cap_no_param: Value: 0.1u; Supplier 1: Digi-Key; Supplier Part Number 1: 490-14603-1-ND
C31 C32 C39 = cap: standard, non-polarized capacitor; Supplier 1: Digi-Key; Footprint verified: no
  C31 C32: Supplier Part Number 1: 490-14603-1-ND; Supplier Price 1: 0.08
  C39: Supplier Part Number 1: 490-10474-1-ND; Supplier Price 1: 0.23
D9 = TPD2E009: ESD Suppressors 2-CH; PartNumber: TPD2E009DRTR; Value: TPD2E009DRTR; PartSymbol: TPD2E009DRTR; Supplier 1: Digi-Key; Supplier Part Number 1: 296-25410-1-ND
D10 = TPD2E009: as D13 on sheet uSDcard; PartNumber: TPD2E009DRTR; Value: TPD2E009DRTR; PartSymbol: TPD2E009DRTR; Supplier 1: Digi-Key; Supplier Part Number 1: 296-25410-1-ND
D11 = diode_dual_opposite: BAT54S schottky protection; Value: BAS70W; Supplier 1: Digi-Key; Supplier Part Number 1: BAS70W-05FDICT-ND
IC4 = NCP380HSNAJAAT1G: as IC1 on sheet usb; Value: MIC2009; PartNumber: NCP380HSNAJAAT1G; PartSymbol: NCP380HSNAJAAT1G; Supplier 1: Digi-Key; Supplier Part Number 1: 576-1680-1-ND
M1 = 2309413-1: as M1 on sheet jetson_nano_module; PartNumber: 2309413-1; Value: 2309413-1; PartSymbol: 2309413-1
Q3 Q6 Q7 = NMOS: as Q4 on sheet jetson_nano_module; Value: NX3008NBKW; PartNumber: NX3008NBKW; Supplier 1: Digi-Key; Supplier Part Number 1: 1727-1280-1-ND
R24 R32 R40 = res: Supplier 1: Digi-Key
  R24: Supplier Part Number 1: RMCF0402FT5R60CT-ND
  R32: Supplier Part Number 1: P499LCT-ND
  R40: Supplier Part Number 1: P14.3KLCT-ND
R25-R31 = res: Value: 5R6; Supplier 1: Digi-Key; Supplier Part Number 1: RMCF0402FT5R60CT-ND
R33-R39 = res: Value: 499R; Supplier 1: Digi-Key; Supplier Part Number 1: P499LCT-ND
R41-R49 R56 = res: 100K; Supplier 1: Digi-Key
  R41 R42 R45: Supplier Part Number 1: P10.0KLCT-ND
  R43 R44: Supplier Part Number 1: P2.00KLCT-ND
  R46: Supplier Part Number 1: P162KLCT-ND
  R47 R48: Supplier Part Number 1: P100KLCT-ND
  R49: Supplier Part Number 1: P33.0KLCT-ND
  R56: Supplier Part Number 1: 311-150HRCT-ND
U6 = CMP-04881-000001-1: IC TRNSLTR BIDIRECTIONAL 8VSSOP; Manufacturer: Texas Instruments; Sigbufrep Type: Buffer; Interface: I2C,SMBus; Min Supply Voltage: 0.9V; Max Supply Voltage: 5.5V; Standoff Height: 0.05mm; Nominal Supply Current: 1.5-3mA; Input Capacitance: 6-8pF; Number of Outputs: 2; Propagation Delay: 110ns; Output Current: 6mA; Logic Function: Translator; Turn-On Delay Time: 100ns; Max Frequency: 400kHz; Output Type: Voltage; Mouser Description: Interface - Signal Buffers, Repeaters Level-Translating I2C Bus Repeater; Manufacturer Part Number: TCA9517DGKR; Ambient Temperature Range Low: -40°C; ComponentLink2URL: http://www.ti.com/lit/ds/symlink/tca9517.pdf; Lead Free: Yes; Temperature: -40°C to +85°C; Device Class L1: Integrated Circuits (ICs); Temperature Range High: +85°C; Octopart: https://octopart.com/tca9517dgkr-texas+instruments-25896020; Ambient Temperature Range High: +85°C; Temperature Range Low: -40°C; Device Class L3: Repeaters; Device Class L2: Interface ICs; Category: IC; Height: 1.1mm; RoHS: TRUE; Automotive: No; ComponentLink2Description: Datasheet; Digikey Description: IC TRNSLTR BIDIRECTIONAL 8VSSOP; Package: DGK0008A; Ipc Land Pattern Name: SOP65P300X110-8; Supplier 1: Digi-Key; Supplier Part Number 1: 296-35972-1-ND; Stock 1: 25898; Pricing 1: 1=0,92000, 10=0,82600, 25=0,78400, 100=0,60200, 250=0,53200, 500=0,50400, 1000=0,39200 (USD); Mount: Surface Mount; Case/Package: VSSOP; Number of Pins: 8; Weight: 0.001058oz; Contact Plating: Gold,Silver; Min Operating Temperature: -40°C; Max Operating Temperature: 85°C; Packaging: Tape and Reel; Package Quantity: 2500; Number of Channels: 2; Number of Inputs: 2; Number of Bits: 2; Length: 3.1mm; Width: 3.1mm; Radiation Hardening: No; REACH SVHC: No SVHC; ComponentLink1URL: https://datasheet.ciiva.com/15395/scps242b-261267-15395636.pdf?src-supplier=Mouser; ComponentLink1Description: https://datasheet.ciiva.com/15395/scps242b-261267-15395636.pdf?src-supplier=Mouser; ComponentLink3URL: https://datasheet.ciiva.com/18613/tca9517-18613430.pdf?src-supplier=Digi-Key; ComponentLink3Description: https://datasheet.ciiva.com/18613/tca9517-18613430.pdf?src-supplier=Digi-Key; ComponentLink4URL: https://datasheet.ciiva.com/18613/tca9517-18613431.pdf?src-supplier=Digi-Key; ComponentLink4Description: https://datasheet.ciiva.com/18613/tca9517-18613431.pdf?src-supplier=Digi-Key; ComponentLink5URL: https://datasheet.ciiva.com/15047/tca9517-15047752.pdf?src-supplier=Digi-Key; ComponentLink5Description: https://datasheet.ciiva.com/15047/tca9517-15047752.pdf?src-supplier=Digi-Key; ComponentLink6URL: https://datasheet.ciiva.com/18613/tca9517-18613432.pdf?src-supplier=Digi-Key; ComponentLink6Description: https://datasheet.ciiva.com/18613/tca9517-18613432.pdf?src-supplier=Digi-Key; ComponentLink7URL: https://datasheet.ciiva.com/15222/getdatasheetpartid-728238-15222172.pdf?src-supplier=Verical; ComponentLink7Description: https://datasheet.ciiva.com/15222/getdatasheetpartid-728238-15222172.pdf?src-supplier=Verical
E2 E3 = TPD4E02B04: Supplier 1: Digi-Key; Supplier Part Number 1: 296-43875-1-ND
J5 = HDMI_C: Supplier 1: Digi-Key; Supplier Part Number 1: 732-2739-1-ND

## Sheet csi_cam.SchDoc: MIPI CSI camera interface
size A3; Author: Olexandr Gudozhnik; Organization: EPFL-STI-LIS; Address1: EPFL, Station 9; Address2: 1015, Lausanne; Address3: Switzerland; DocumentNumber: 8; SheetNumber: 8; SheetTotal: 8
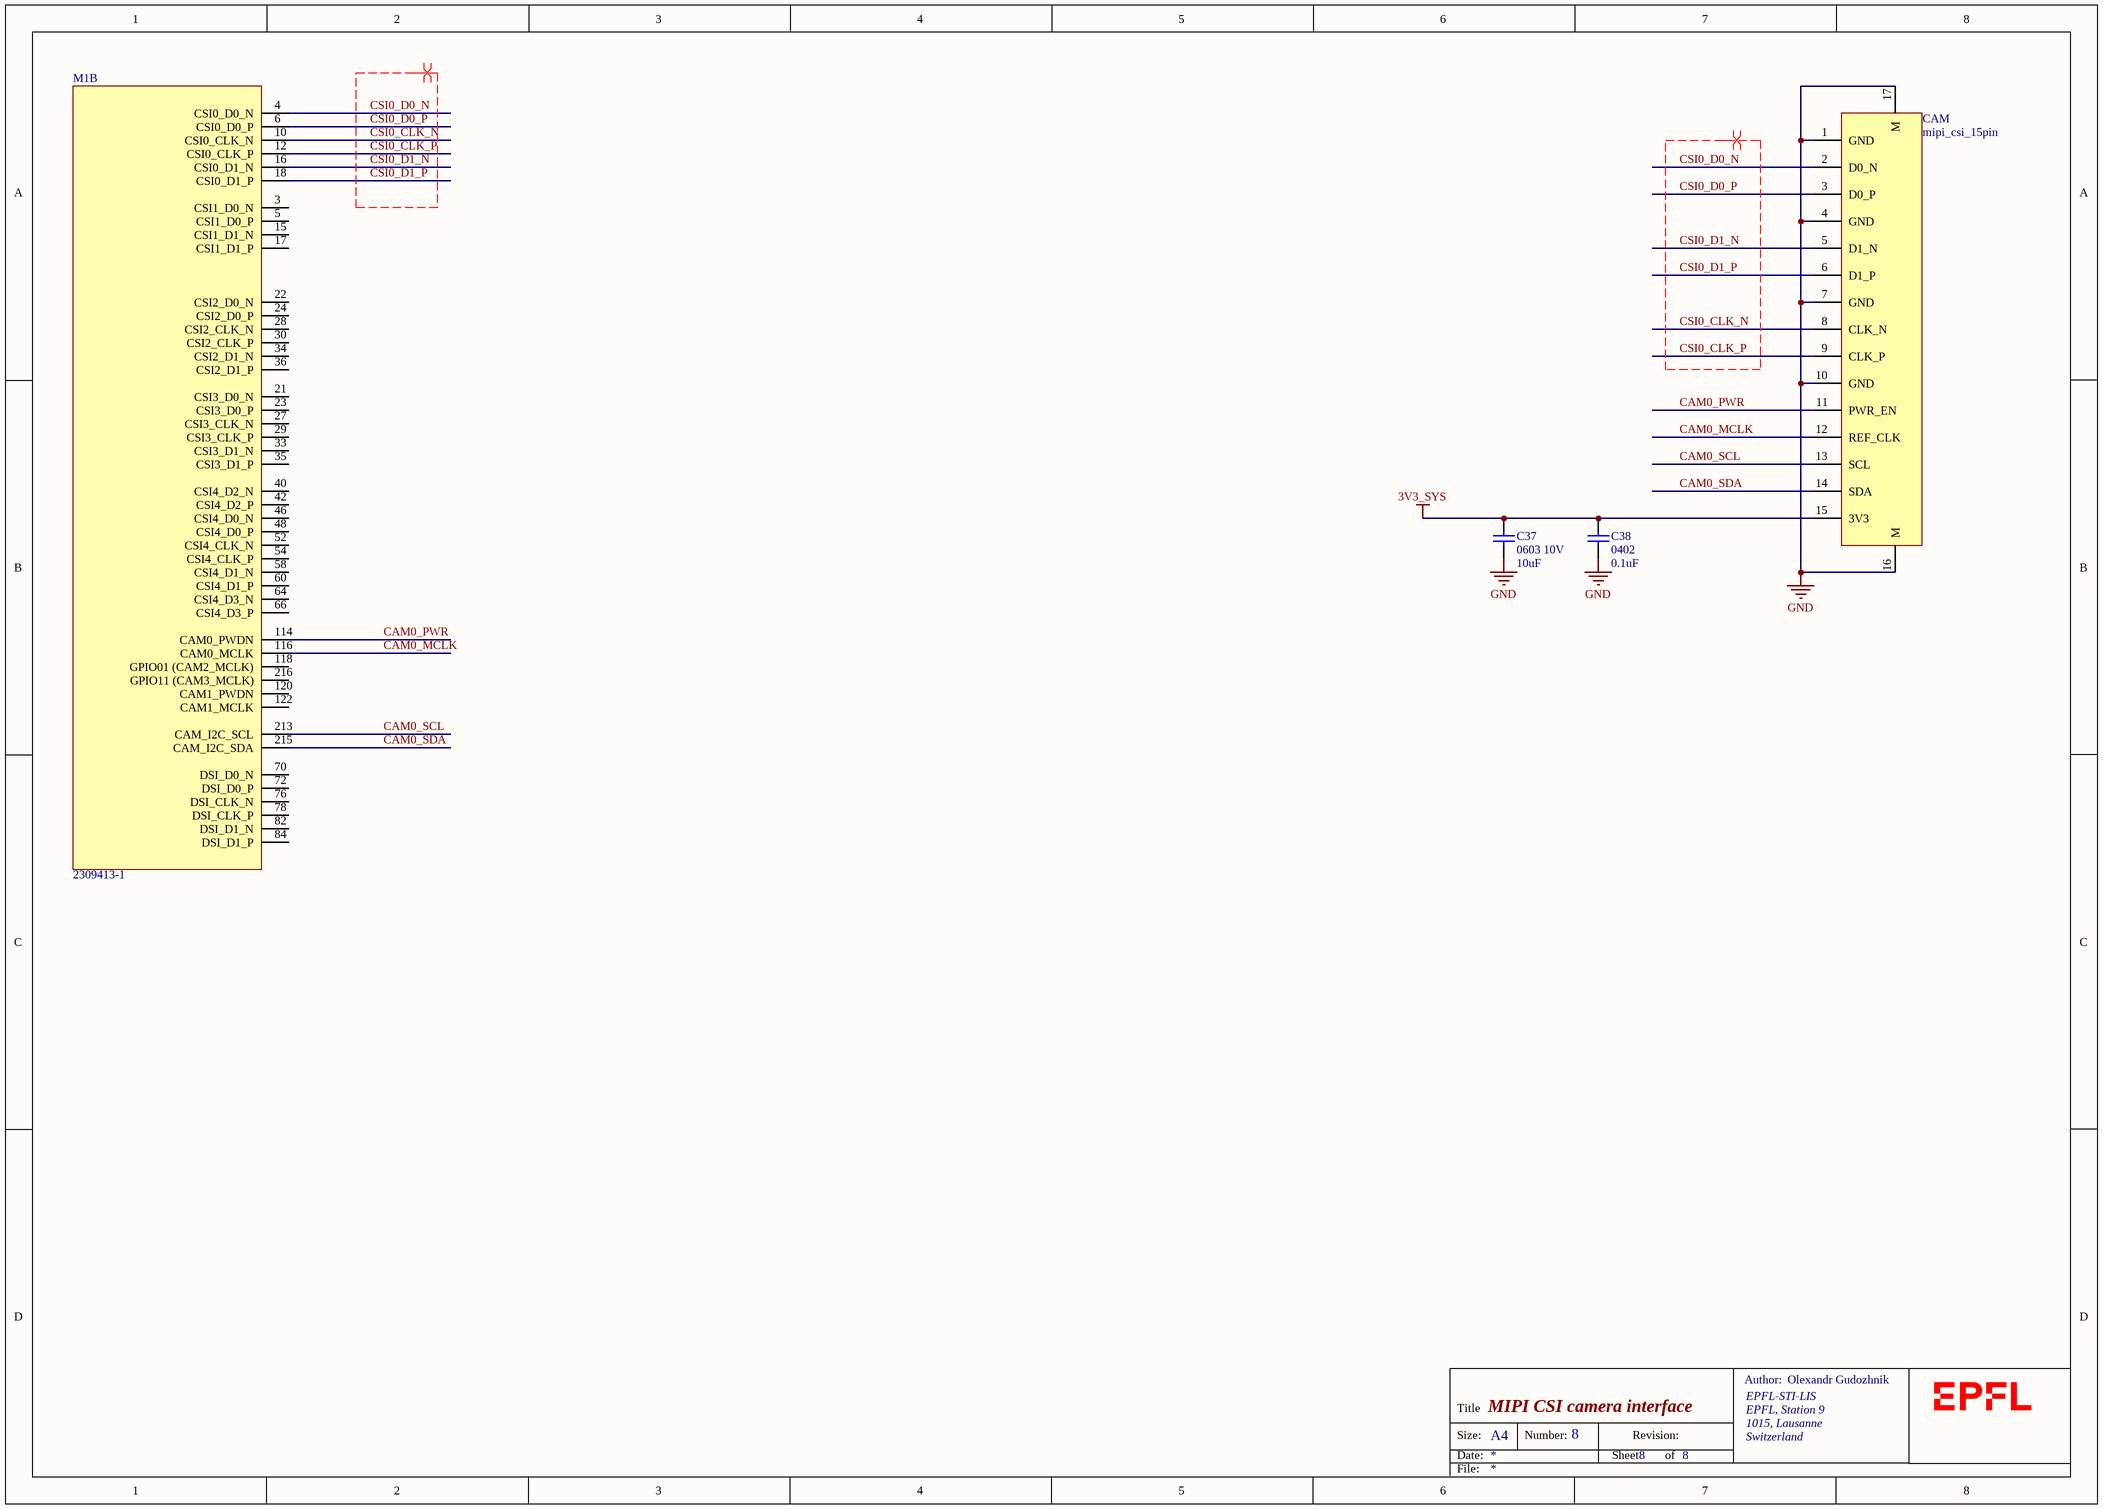
[diagram p7: csi_cam.SchDoc]

### Parts
C37  0603 10V  value 10uF  [cap0603]
C38  0402  value 0.1uF  [cap0402]
CAM  mipi_csi_15pin  [molex_52271_15pin]
M1  2309413-1  [jetson-nano-connector]  (part B of 7)

### Nets
3V3_SYS: C37.2 C38.1 CAM.15(3V3)
GND: C37.1 C38.2 CAM.1(GND) CAM.4(GND) CAM.7(GND) CAM.10(GND) CAM.16(M) CAM.17(M)
CAM0_MCLK: CAM.12(REF_CLK) M1.116(CAM0_MCLK)
CAM0_PWR: CAM.11(PWR_EN) M1.114(CAM0_PWDN)
CAM0_SCL: CAM.13(SCL) M1.213(CAM_I2C_SCL)
CAM0_SDA: CAM.14(SDA) M1.215(CAM_I2C_SDA)
CSI0_CLK_N: CAM.8(CLK_N) M1.10(CSI0_CLK_N)
CSI0_CLK_P: CAM.9(CLK_P) M1.12(CSI0_CLK_P)
CSI0_D0_N: CAM.2(D0_N) M1.4(CSI0_D0_N)
CSI0_D0_P: CAM.3(D0_P) M1.6(CSI0_D0_P)
CSI0_D1_N: CAM.5(D1_N) M1.16(CSI0_D1_N)
CSI0_D1_P: CAM.6(D1_P) M1.18(CSI0_D1_P)

Not connected (* = marked no-connect by the designer): M1 3(CSI1_D0_N) 5(CSI1_D0_P) 15(CSI1_D1_N) 17(CSI1_D1_P) 21(CSI3_D0_N) 22(CSI2_D0_N) 23(CSI3_D0_P) 24(CSI2_D0_P) 27(CSI3_CLK_N) 28(CSI2_CLK_N) 29(CSI3_CLK_P) 30(CSI2_CLK_P) 33(CSI3_D1_N) 34(CSI2_D1_N) 35(CSI3_D1_P) 36(CSI2_D1_P) 40(CSI4_D2_N) 42(CSI4_D2_P) 46(CSI4_D0_N) 48(CSI4_D0_P) 52(CSI4_CLK_N) 54(CSI4_CLK_P) 58(CSI4_D1_N) 60(CSI4_D1_P) 64(CSI4_D3_N) 66(CSI4_D3_P) 70(DSI_D0_N) 72(DSI_D0_P) 76(DSI_CLK_N) 78(DSI_CLK_P) 82(DSI_D1_N) 84(DSI_D1_P) 118(GPIO01_(CAM2_MCLK)) 120(CAM1_PWDN) 122(CAM1_MCLK) 216(GPIO11_(CAM3_MCLK))

### Layout directives
differential pair; differential pair class DIFF95; differential pair class CSI: CSI0_CLK_N, CSI0_CLK_P, CSI0_D0_N, CSI0_D0_P, CSI0_D1_N, CSI0_D1_P

### Notes on the sheet
- Author:
- Title
- Size:
- Date:
- A4
- Number:
- Sheet
- Revision:
- of
- File:

### Library data of the parts
C37 C38 = cap: standard, non-polarized capacitor; Supplier 1: Digi-Key; Footprint verified: no
  C37: Supplier Part Number 1: 490-10474-1-ND; Supplier Price 1: 0.23
  C38: Supplier Part Number 1: 490-14603-1-ND; Supplier Price 1: 0.08
CAM = mipi_csi_15pin: 15 pin FPC connector; Supplier 1: Digi-Key; Supplier Part Number 1: WM10967CT-ND
M1 = 2309413-1: as M1 on sheet jetson_nano_module; PartNumber: 2309413-1; Value: 2309413-1; PartSymbol: 2309413-1

## Nets that join several sheets
1V8_SYS: power (1.8V.1 C19.2 U5.5), jetson_nano_module (Q5.1 R55.1 U8.6), uart (6 pins), hdmi (R45.1)
3V3_SYS: power (3.3V.1 C20.2 R11.1 U5.1), uart (7 pins), uSDcard (C33.1 SD1.4), hdmi (7 pins), csi_cam (C37.2 C38.1 CAM.15)
5V0_SYS: power (12 pins), jetson_nano_module (5 pins), uart (I2C.1), usb (IC1.1 IC3.1 R20.1 R50.1), hdmi (IC4.1)
GND: power (35 pins), jetson_nano_module (82 pins), uart (10 pins), usb (36 pins), uSDcard (10 pins), hdmi (23 pins), csi_cam (8 pins)
#MOD_SLEEP: jetson_nano_module (M1.178), hdmi (IC4.3 Q3.1 R40.1)
#SHDN_REQ: power (IC2.4 R16.1), jetson_nano_module (M1.233 SHDN_REQ.1)
#SYS_RESET: power (U4.9 U5.3), jetson_nano_module (M1.239 RES.2 RST.1), usb (IC1.3 IC3.3)
MOD_POWER_EN: power (IC2.8), jetson_nano_module (M1.237 PWR_EN.1)
PGOOD: power (DCDC1.3), jetson_nano_module (Q4.1)
SD_CD: jetson_nano_module (M1.208), uSDcard (SD1.9)
SD_CLK: jetson_nano_module (M1.229), uSDcard (D14.2 SD1.5)
SD_CMD: jetson_nano_module (M1.227), uSDcard (D14.1 SD1.3)
SD_DAT0: jetson_nano_module (M1.219), uSDcard (D15.1 SD1.7)
SD_DAT1: jetson_nano_module (M1.221), uSDcard (D15.2 SD1.8)
SD_DAT2: jetson_nano_module (M1.223), uSDcard (D13.1 SD1.1)
SD_DAT3: jetson_nano_module (M1.225), uSDcard (D13.2 SD1.2)